# EasyEDA Pro project 缓启动开关工程文件_2024-11-13.epro

# Schematic NMOS低侧开关
Board Name: NMOS低侧开关; Create Date: 2024-10-30; Page Name: P1; Project Name: 缓启动开关; Schematic Name: NMOS低侧开关; Update Date: 2024-10-30; Company: 嘉立创EDA; Page Size: A4; Version: V1.0
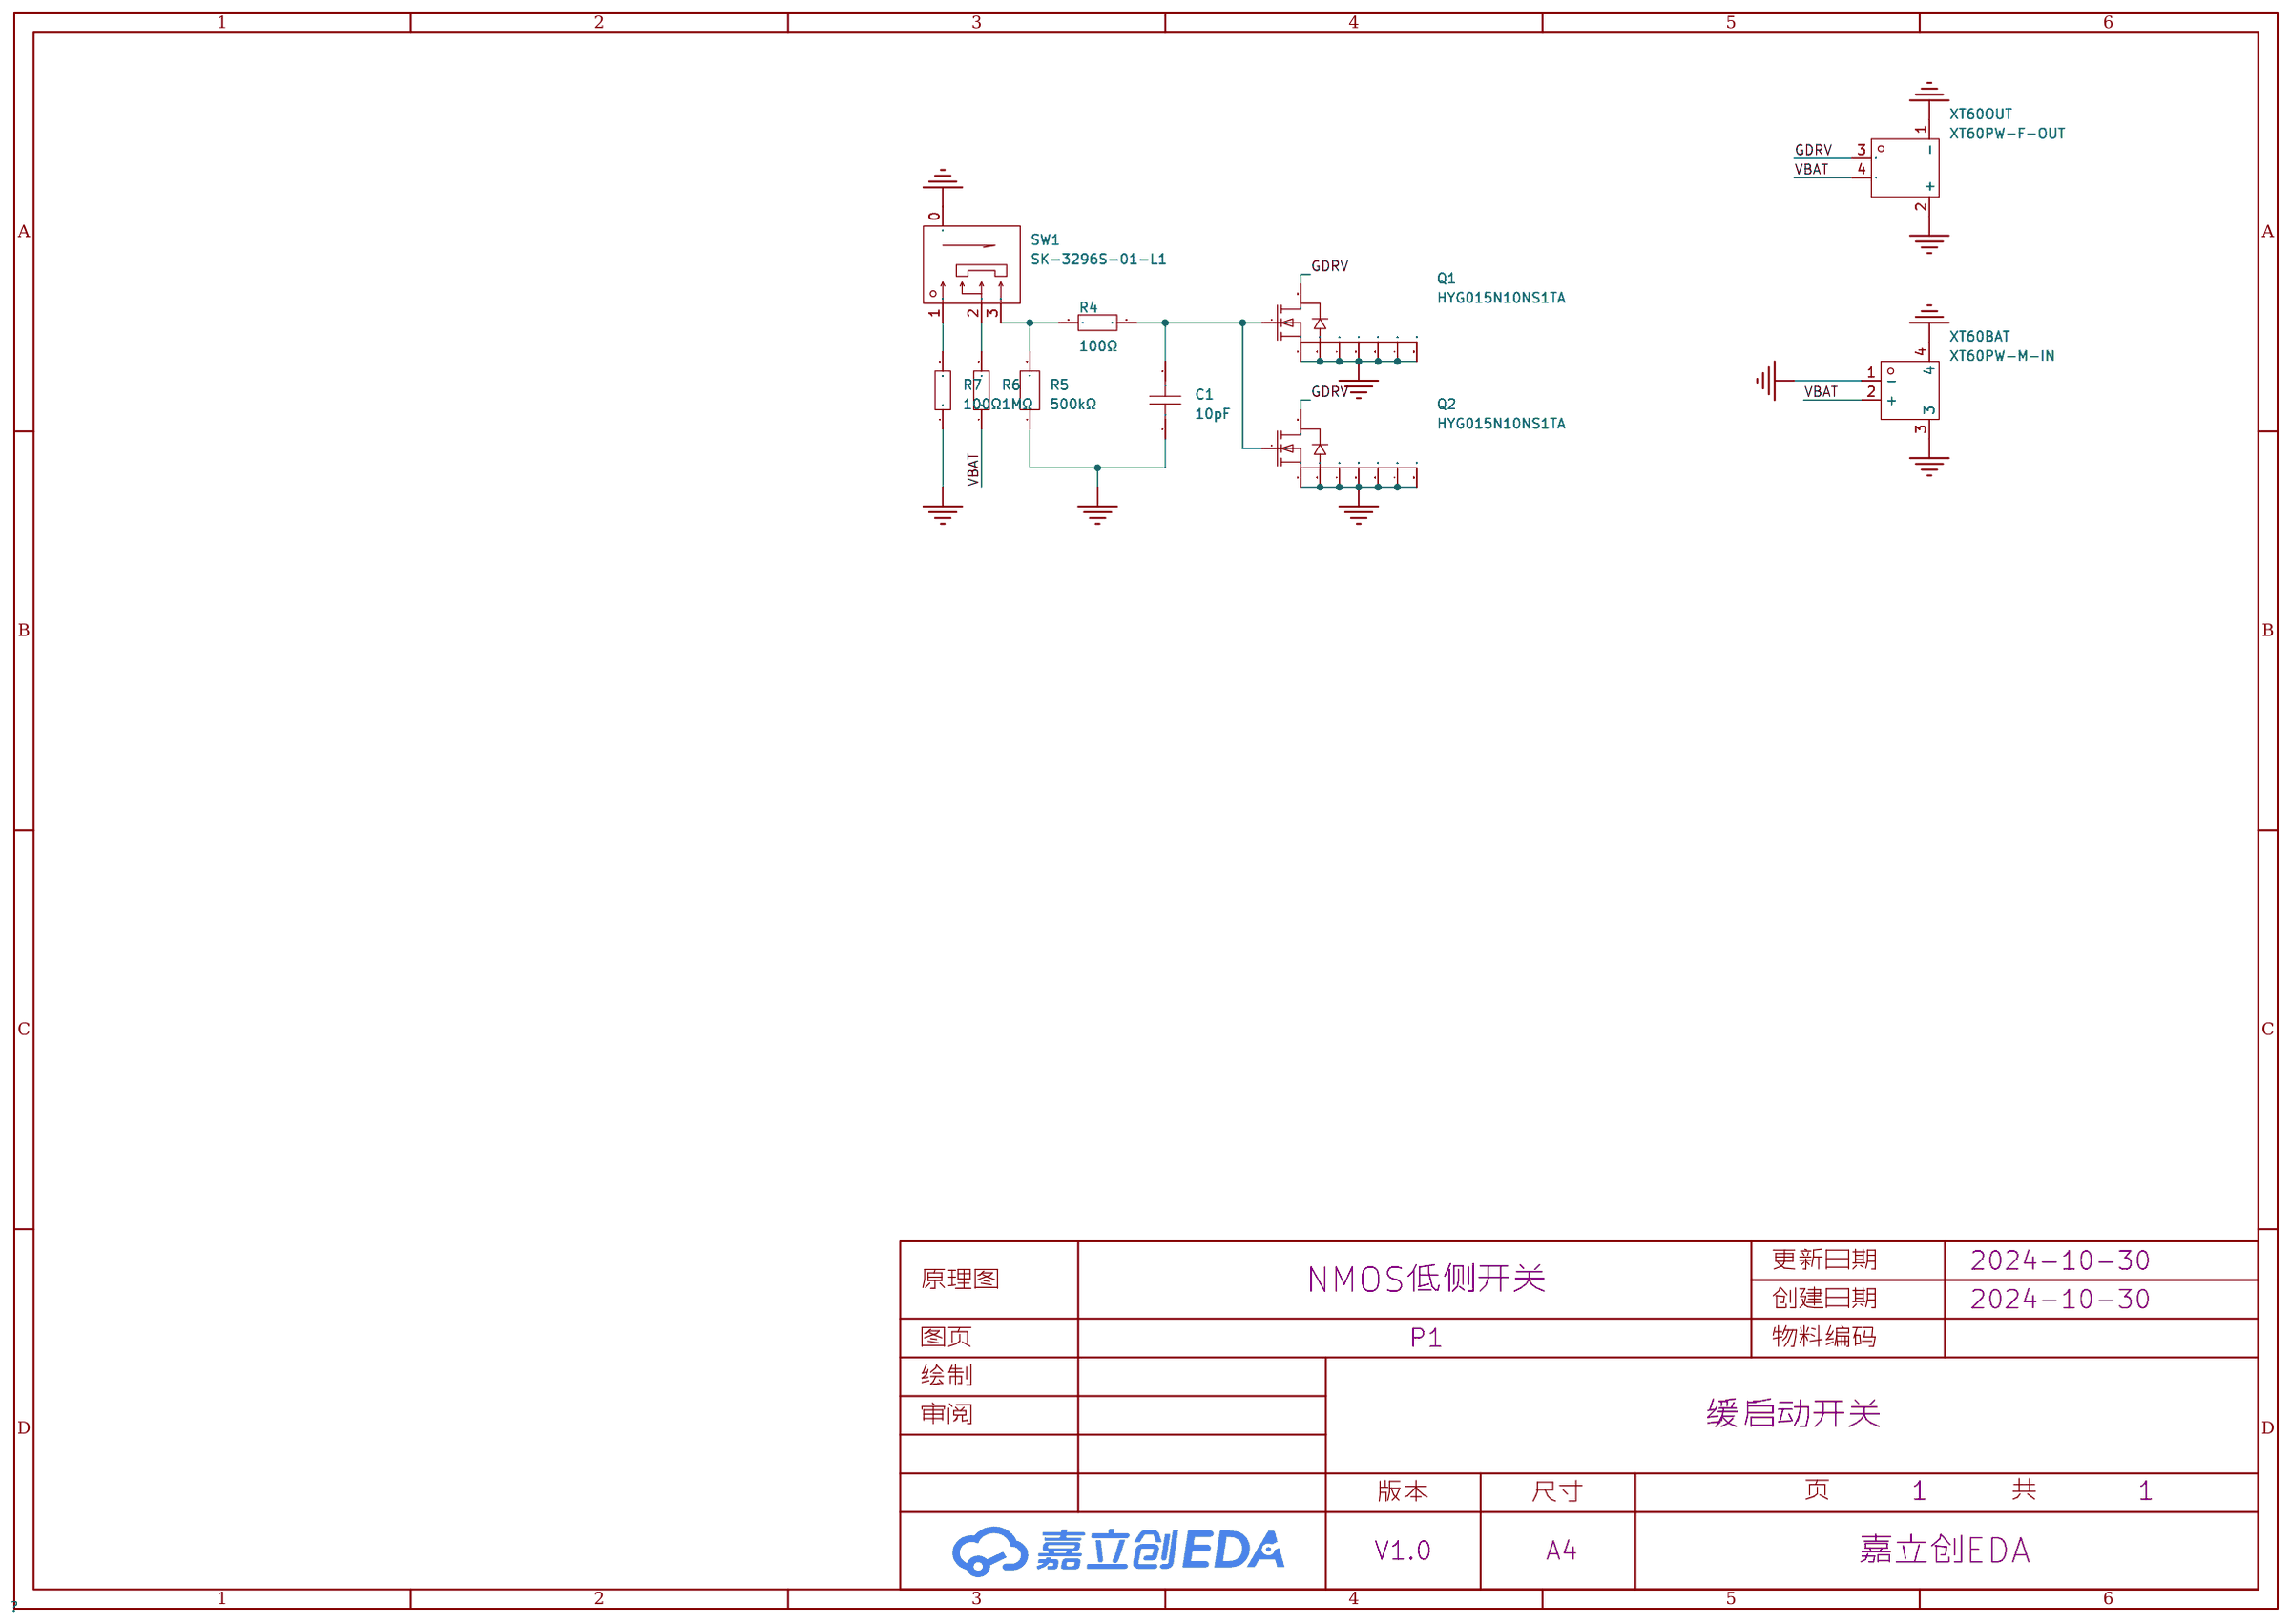
[diagram p0: schematic sheet]

## Parts
C1  10pF  [R0603]
Q1  HYG015N10NS1TA  [TOLL-8_L10.4-W9.9-P1.20-LS11.7-BL]
Q2  HYG015N10NS1TA  [TOLL-8_L10.4-W9.9-P1.20-LS11.7-BL]
R4  100Ω  [R0603]
R5  500kΩ  [R0603]
R6  1MΩ  [R0603]
R7  100Ω  [R0603]
SW1  SK-3296S-01-L1  [SW-SMD_3P-P1.50_L2.7-W6.6]
XT60BAT  XT60PW-M-IN  [CONN-TH_XT60PW-M]
XT60OUT  XT60PW-F-OUT  [TH_2P-XT60PW-F]

## Library data of the parts
C1 = GCM1885C2A100FA16D: 容值:10pF;精度:±1%;额定电压:100V;材质(温度系数):C0G;; LCSC Part Name: 10pF ±1% 100V; Supplier Part: C882577; Manufacturer: muRata(村田); Supplier Footprint: 0603; JLCPCB Part Class: 扩展库; Datasheet: https://atta.szlcsc.com/upload/public/pdf/source/20210506/8597E15C5779E6978C1CE8BB0035B528.pdf; Supplier: LCSC; Tolerance: ±1%; Voltage Rated: 100V; Temperature Coefficient: C0G
Q1 Q2 = HYG015N10NS1TA: 类型:N沟道;漏源电压(Vdss):100V;连续漏极电流(Id):380A;功率(Pd):428.5W;导通电阻(RDS(on)@Vgs,Id):1.2mΩ@10V,100A;阈值电压(Vgs(th)@Id):3V@250uA;; LCSC Part Name: N沟道 耐压:100V 电流:380A; Supplier Part: C2979263; Manufacturer: HUAYI(华羿微); Supplier Footprint: TOLL-8; JLCPCB Part Class: 扩展库; Datasheet: https://atta.szlcsc.com/upload/public/pdf/source/20220303/83427DBE0CDF10F23F3FDD49B9C9CFAE.pdf; Supplier: LCSC; Type: N沟道; Drain Source Voltage (Vdss): 100V; Continuous Drain Current (Id): 380A; Power Dissipation (Pd): 428.5W; Drain Source On Resistance (RDS(on)@Vgs,Id): 1.2mΩ@10V,100A; Gate Threshold Voltage (Vgs(th)@Id): 3V@250uA; Total Gate Charge (Qg@Vgs): 205nC@10V; Input Capacitance (Ciss@Vds): 12.3nF@25V; Reverse Transfer Capacitance (Crss@Vds): 250pF@25V; Operating Temperature: -55℃~+175℃@(Tj)
R4 R7 = 0603WAF1000T5E: 电阻类型:厚膜电阻;阻值:100Ω;精度:±1%;功率:100mW;最大工作电压:75V;温度系数:±200ppm/℃;; LCSC Part Name: 100Ω ±1% 100mW 厚膜电阻; Supplier Part: C22775; Manufacturer: UNI-ROYAL(厚声); Supplier Footprint: 0603; JLCPCB Part Class: 基础库; Datasheet: https://atta.szlcsc.com/upload/public/pdf/source/20200306/C422600_1E6D84923E4A46A82E41ADD87F860B5C.pdf; Supplier: LCSC; Type: 厚膜电阻; Tolerance: ±1%; Power(Watts): 100mW; Overload Voltage (Max): 75V; Temperature Coefficient: ±200ppm/℃; Operating Temperature Range: -55℃~+155℃
R5 = AR03BTCX5003N: 电阻类型:薄膜电阻;阻值:500kΩ;精度:±0.1%;功率:100mW;最大工作电压:50V;温度系数:±25ppm/℃;; LCSC Part Name: 薄膜电阻 500kΩ ±0.1% 100mW; Supplier Part: C2902631; Manufacturer: Viking(光颉); Supplier Footprint: 0603; JLCPCB Part Class: 扩展库; Datasheet: https://atta.szlcsc.com/upload/public/pdf/source/20191129/C465721_10D49275DB41E427863CE9C8D788770A.pdf; Supplier: LCSC; Type: 薄膜电阻; Tolerance: ±0.1%; Power(Watts): 100mW; Overload Voltage (Max): 50V; Temperature Coefficient: ±25ppm/℃; Operating Temperature Range: -55℃~+155℃
R6 = 0603WAF1004T5E: 电阻类型:厚膜电阻;阻值:1MΩ;精度:±1%;功率:100mW;最大工作电压:75V;温度系数:±100ppm/℃;; LCSC Part Name: 1MΩ ±1% 100mW 厚膜电阻; Supplier Part: C22935; Manufacturer: UNI-ROYAL(厚声); Supplier Footprint: 0603; JLCPCB Part Class: 基础库; Datasheet: https://atta.szlcsc.com/upload/public/pdf/source/20200306/C422600_1E6D84923E4A46A82E41ADD87F860B5C.pdf; Supplier: LCSC; Type: 厚膜电阻; Tolerance: ±1%; Power(Watts): 100mW; Overload Voltage (Max): 75V; Temperature Coefficient: ±100ppm/℃; Operating Temperature Range: -55℃~+155℃
SW1 = SK-3296S-01-L1: 电路结构:单刀双掷;安装方式:卧贴;开关颜色:黑色;额定电流(DC):50mA;额定电压(DC):12V;额定电流(AC):50mA;额定电压(AC):12V;机械寿命:1万次;; LCSC Part Name: 柄长1.5mm 卧贴双档 滑动开关; Supplier Part: C319020; Manufacturer: XKB Connectivity(中国星坤); Supplier Footprint: SMD; JLCPCB Part Class: 扩展库; Datasheet: https://atta.szlcsc.com/upload/public/pdf/source/20211011/33977E7F5E3AE40A3E3DC6795807E20F.pdf; Supplier: LCSC; Circuit: 单刀双掷; Actuator Style: 矩形柱状; Pin Style: SMD接片; Switch Length: 7.8mm; Switch Width: 2.75mm; Switch Height: 1.35mm; Mounting Style: 卧贴; Actuator Color: 黑色; Current Rating (DC): 50mA; Voltage Rating (DC): 12V; Current Rating (AC): 50mA; Voltage Rating (AC): 12V; Mechanical Life: 1万次; Operating Temperature: -40℃~+85℃
XT60BAT = XT60PW-M: 类别:-;类型1:-;; LCSC Part Name: AMASS(艾迈斯)航模插头xt60连接器150公母对接pw锂电池公头 板插卧式XT60PW-M; Supplier Part: C98732; Manufacturer: AMASS(艾迈斯); JLCPCB Part Class: 扩展库; Datasheet: https://atta.szlcsc.com/upload/public/pdf/source/20240118/44A3DCFF53BE25DC65378AFFB21277A4.pdf; Supplier: LCSC; Brand: 艾迈斯; Type: 卧式插头; Colour: 黄色; InterfaceType: 公头
XT60OUT = XT60PW-F: 类别:-;类型1:-;; LCSC Part Name: AMASS(艾迈斯)插头连接器锂电池组充电接口 航模电调卧式焊板 母头 XT60PW-F; Supplier Part: C428722; Manufacturer: AMASS(艾迈斯); JLCPCB Part Class: 扩展库; Datasheet: https://atta.szlcsc.com/upload/public/pdf/source/20190916/C428722_DFF78979486FCB0B58C1FC563067EC88.pdf; Supplier: LCSC; Type: 卧式插头; Colour: 黄色; InterfaceType: 母头

## Nets
GND: C1.1 Q1.2(S) Q1.3(S) Q1.4(S) Q1.5(S) Q1.6(S) Q1.7(S) Q1.8(S) Q2.2(S) Q2.3(S) Q2.4(S) Q2.5(S) Q2.6(S) Q2.7(S) Q2.8(S) R5.1 R7.1 SW1.0 XT60BAT.1(-) XT60BAT.3 XT60BAT.4 XT60OUT.1(-) XT60OUT.2(+)
VBAT: R6.1 XT60BAT.2(+) XT60OUT.4
GDRV: Q1.9(D) Q2.9(D) XT60OUT.3
$1N665: R4.1 R5.2 SW1.3
$1N772: R6.2 SW1.2
$1N909: R7.2 SW1.1
Net-(C1-2): C1.2 Q1.1(G) Q2.1(G) R4.2

# Schematic 电荷泵NMOS高侧开关
Board Name: 电荷泵NMOS高侧开关; Create Date: 2024-10-29; Page Name: P1; Project Name: 缓启动开关; Schematic Name: 电荷泵NMOS高侧开关; Update Date: 2024-11-01; Company: 嘉立创EDA; Page Size: A4; Version: V1.0
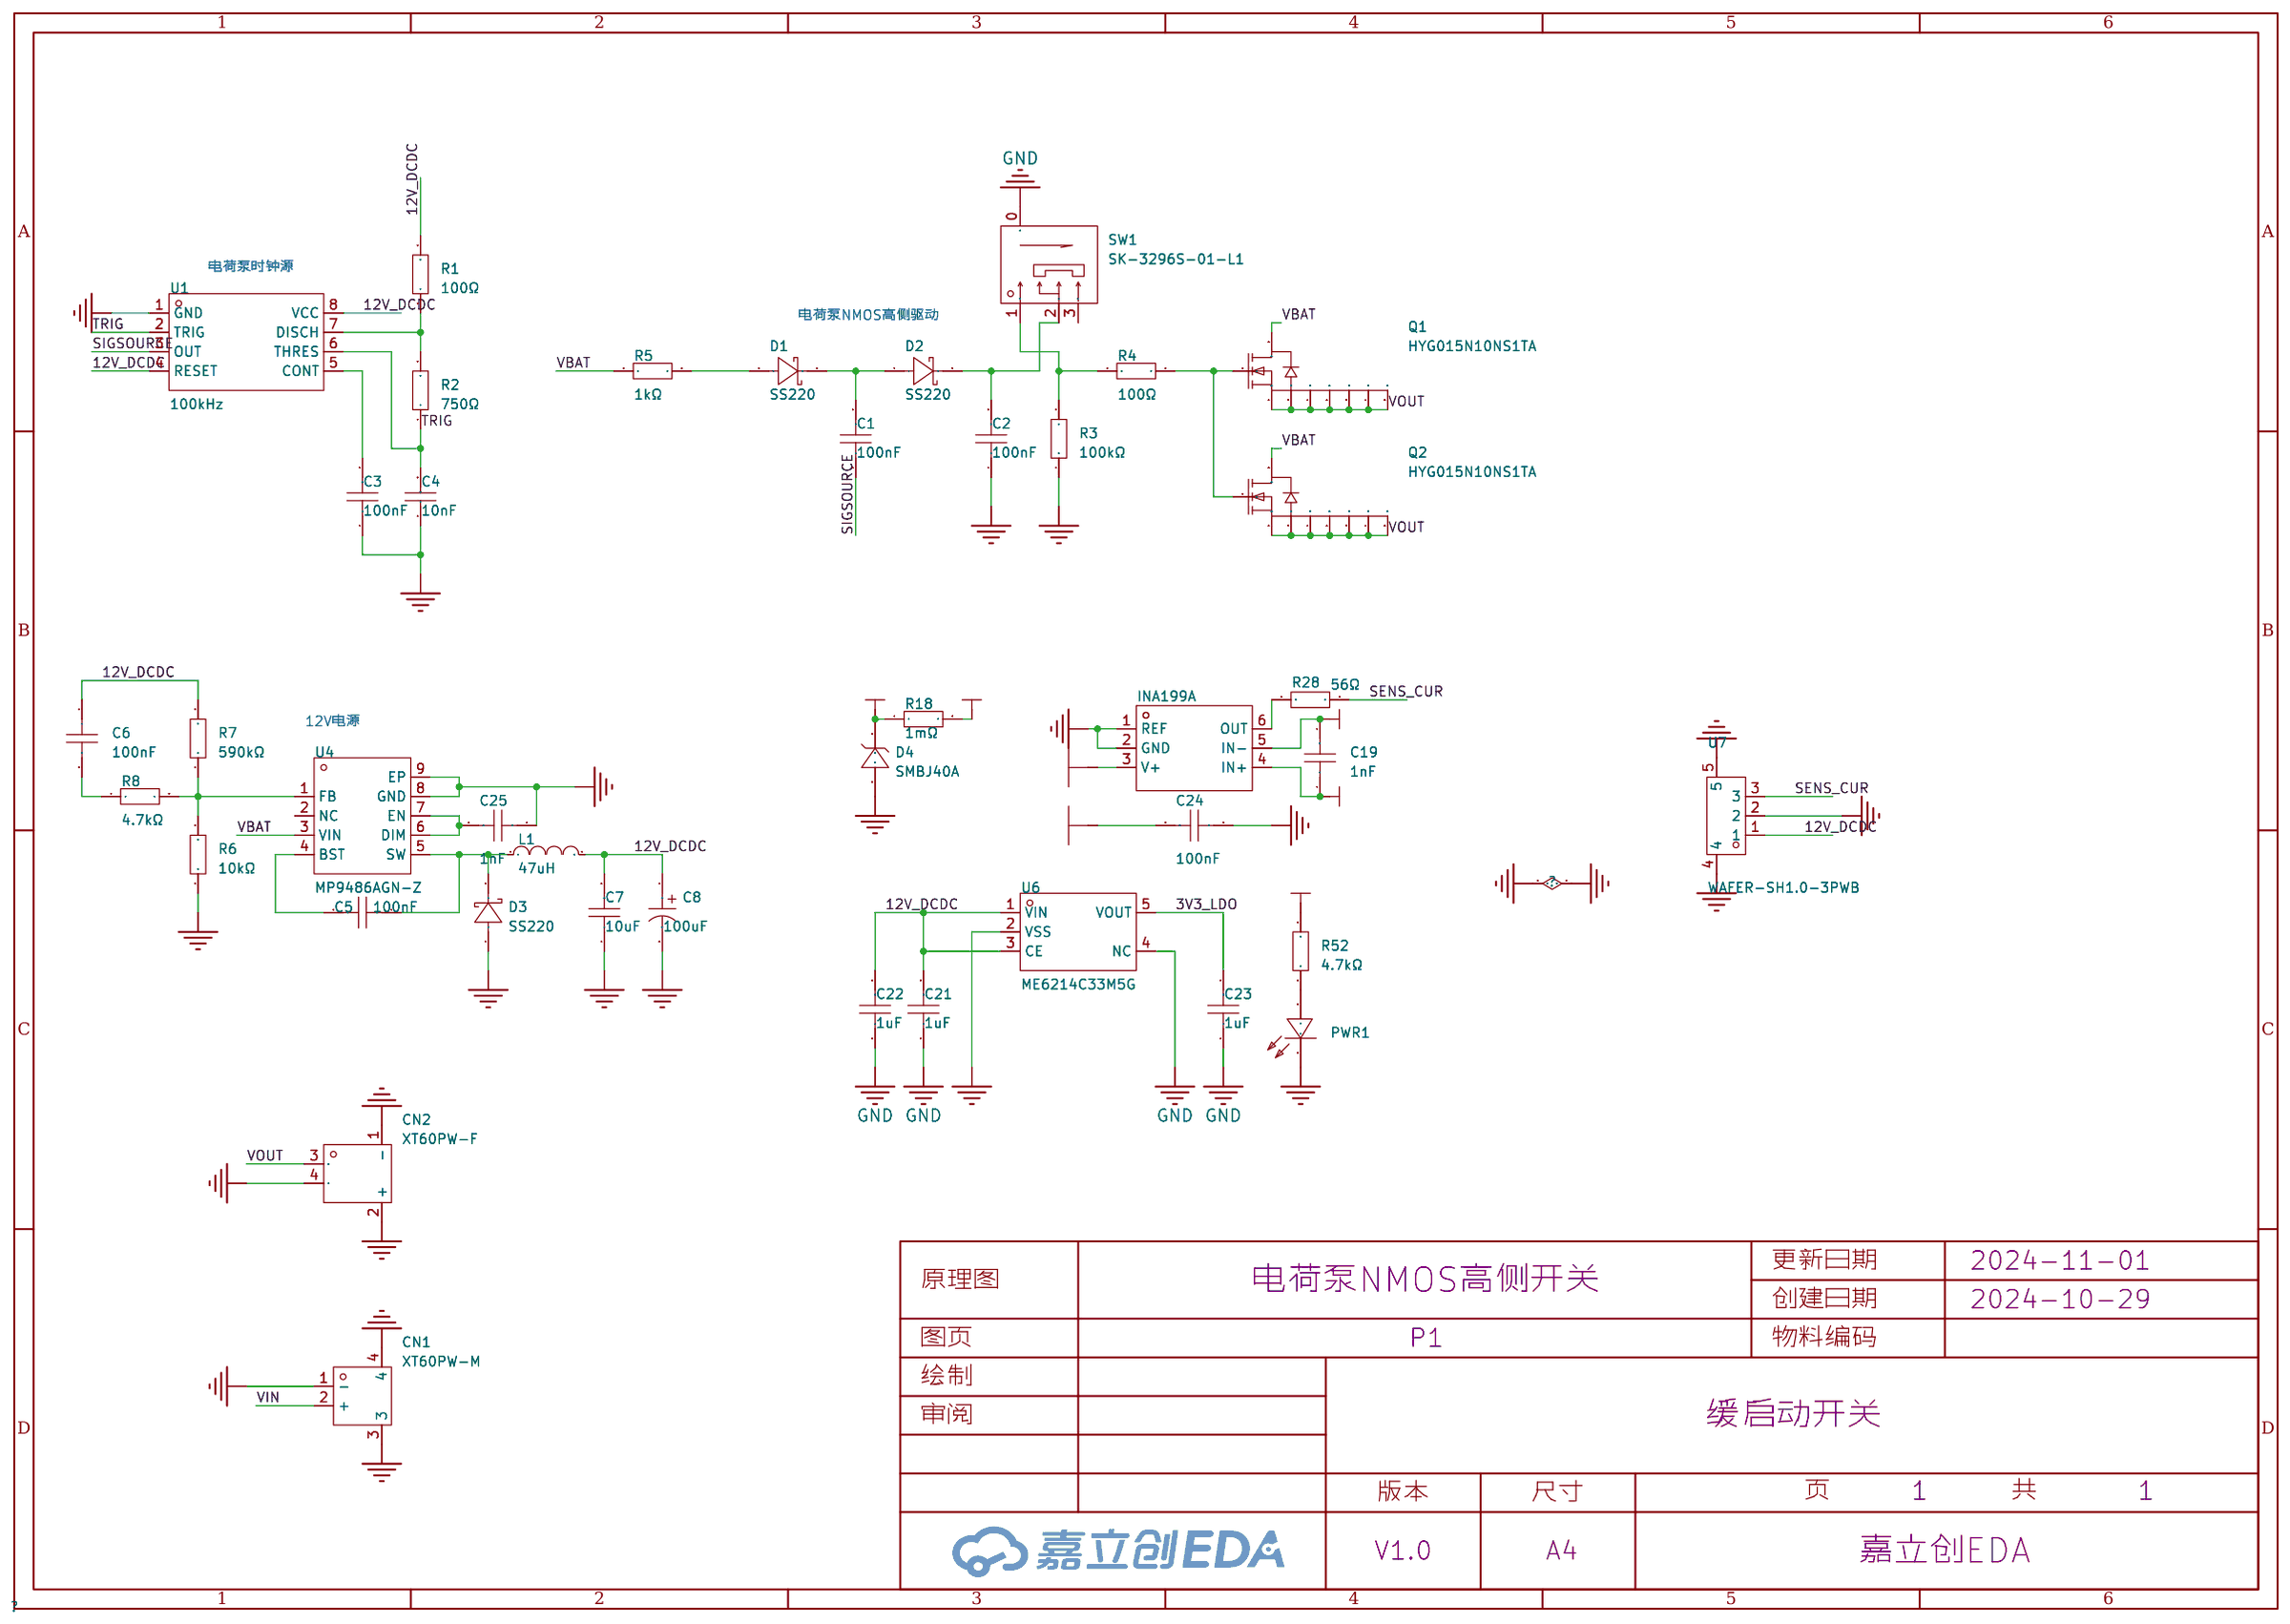
[diagram p1: schematic sheet]

## Parts
C1  100nF  [R0603]
C2  100nF  [R0603]
C3  100nF  [R0603]
C4  10nF  [R0603]
C5  100nF  [R0603]
C6  100nF  [R0603]
C7  10uF  [R0603]
C8  100uF  [cap-smd_bd6.3-l6.6-w6.6-ls7.4-fd]
C19  1nF  [R0603]
C21  1uF  [R0603]
C22  1uF  [R0603]
C23  1uF  [R0603]
C24  100nF  [R0603]
C25  1nF  [R0603]
CN1  XT60PW-M  [CONN-TH_XT60PW-M]
CN2  XT60PW-F  [TH_2P-XT60PW-F]
D1  SS220  [SMA_L4.3-W2.6-LS5.0-FD]
D2  SS220  [SMA_L4.3-W2.6-LS5.0-FD]
D3  SS220  [SMA_L4.3-W2.6-LS5.0-FD]
D4  SMBJ40A  [SMB_L4.3-W3.6-LS5.3-RD]
INA199A  INA199A1DCKR  [SC-70-6_L2.2-W1.3-P0.65-LS2.1-BR]
L1  47uH  [IND-SMD_L4.0-W4.0_FNR40XXS]
PWR1  NCD0603G1  [LED0603-RD]
Q1  HYG015N10NS1TA  [TOLL-8_L10.4-W9.9-P1.20-LS11.7-BL]
Q2  HYG015N10NS1TA  [TOLL-8_L10.4-W9.9-P1.20-LS11.7-BL]
R1  100Ω  [R0603]
R2  750Ω  [R0603]
R3  100kΩ  [R0603]
R4  100Ω  [R0603]
R5  1kΩ  [R0603]
R6  10kΩ  [R0603]
R7  590kΩ  [R0603]
R8  4.7kΩ  [R0603]
R18  1mΩ  [R3920]
R28  56Ω  [R0603]
R52  4.7kΩ  [R0603]
SW1  SK-3296S-01-L1  [SW-SMD_3P-P1.50_L2.7-W6.6]
U1  100kHz  [TSSOP-8_L4.4-W3.0-P0.65-LS6.4-BL]
U4  MP9486AGN-Z  [SOIC-8_L4.9-W3.9-P1.27-LS6.0-BL-EP3.1]
U6  ME6214C33M5G  [SOT-23-5_L3.0-W1.7-P0.95-LS2.8-BL]
U7  WAFER-SH1.0-3PWB  [CONN-SMD_3P-P1.00_WAFER-SH1.0-3PWB]

## Library data of the parts
C1 C2 C5 C6 C24 = CC0603KRX7R0BB104: 容值:100nF;精度:±10%;额定电压:100V;材质(温度系数):X7R;; LCSC Part Name: 100nF ±10% 100V; Supplier Part: C113803; Manufacturer: YAGEO(国巨); Supplier Footprint: 0603; JLCPCB Part Class: 扩展库; Datasheet: https://atta.szlcsc.com/upload/public/pdf/source/20181015/C113803_C823A7F2167996AC3CF21DCEABCAAB90.pdf; Supplier: LCSC; Tolerance: ±10%; Voltage Rated: 100V; Temperature Coefficient: X7R
C3 = CGA0603X7R104K500JT: 容值:100nF;精度:±10%;额定电压:50V;材质(温度系数):X7R;; LCSC Part Name: 100nF ±10% 50V; Supplier Part: C6119867; Manufacturer: HRE(芯声); Supplier Footprint: 0603; JLCPCB Part Class: 扩展库; Supplier: LCSC; Tolerance: ±10%; Voltage Rated: 50V; Temperature Coefficient: X7R
C4 = CC0603KRX7R9BB103: 容值:10nF;精度:±10%;额定电压:50V;材质(温度系数):X7R;; LCSC Part Name: 10nF ±10% 50V; Supplier Part: C100042; Manufacturer: YAGEO(国巨); Supplier Footprint: 0603; JLCPCB Part Class: 扩展库; Datasheet: https://atta.szlcsc.com/upload/public/pdf/source/20181008/C309510_22F155564471FAF6A489F7D68F34234E.pdf; Supplier: LCSC; Tolerance: ±10%; Voltage Rated: 50V; Temperature Coefficient: X7R
C7 = HGC1206R5106K500NSPJ: 容值:10uF;精度:±10%;额定电压:50V;材质(温度系数):X5R;; LCSC Part Name: 10uF ±10% 50V; Supplier Part: C7432781; Manufacturer: Chinocera(华瓷); Supplier Footprint: 1206; JLCPCB Part Class: 扩展库; Datasheet: https://atta.szlcsc.com/upload/public/pdf/source/20240320/FAC3FEC40A78BC5CCCE96C232A94D860.pdf; Supplier: LCSC; Tolerance: ±10%; Voltage Rated: 50V; Temperature Coefficient: X5R
C8 = RVT100UF35V67RV0034: 容值:100uF;精度:±20%;额定电压:35V;纹波电流:87mA@120kHz;等效串联电阻:-;; LCSC Part Name: 100uF ±20% 35V; Supplier Part: C2836442; Manufacturer: KNSCHA(科尼盛); Supplier Footprint: SMD,D6.3xL7.7mm; JLCPCB Part Class: 扩展库; Datasheet: https://atta.szlcsc.com/upload/public/pdf/source/20210528/C2836442_7F6389BF36F63F32D6DF3A507E8E95D6.pdf; Supplier: LCSC; Tolerance: ±20%; Rated Voltage: 35V; Ripple Current: 87mA@120kHz; φD: 6.3mm; L: 7.7mm; Lifetime @ Temp: 2000hrs@105℃; Operating Temperature: -55℃~+105℃
C19 C25 = CAP_0402: 容值:100nF;精度:±10%;额定电压:16V;温度系数:X7R;; Supplier Part: C1525; Supplier Footprint: 0402
C21-C23 = CL10A105KB8NNNC: 容值:1uF;精度:±10%;额定电压:50V;材质(温度系数):X5R;; LCSC Part Name: 1uF ±10% 50V; Supplier Part: C15849; Manufacturer: SAMSUNG(三星); Supplier Footprint: 0603; JLCPCB Part Class: 基础库; Datasheet: https://atta.szlcsc.com/upload/public/pdf/source/20160218/1457707763339.pdf; Supplier: LCSC; Tolerance: ±10%; Voltage Rated: 50V; Temperature Coefficient: X5R
CN1 = XT60PW-M: 类别:-;类型1:-;; LCSC Part Name: AMASS(艾迈斯)航模插头xt60连接器150公母对接pw锂电池公头 板插卧式XT60PW-M; Supplier Part: C98732; Manufacturer: AMASS(艾迈斯); JLCPCB Part Class: 扩展库; Datasheet: https://atta.szlcsc.com/upload/public/pdf/source/20240118/44A3DCFF53BE25DC65378AFFB21277A4.pdf; Supplier: LCSC; Brand: 艾迈斯; Type: 卧式插头; Colour: 黄色; InterfaceType: 公头
CN2 = XT60PW-F: 类别:-;类型1:-;; LCSC Part Name: AMASS(艾迈斯)插头连接器锂电池组充电接口 航模电调卧式焊板 母头 XT60PW-F; Supplier Part: C428722; Manufacturer: AMASS(艾迈斯); JLCPCB Part Class: 扩展库; Datasheet: https://atta.szlcsc.com/upload/public/pdf/source/20190916/C428722_DFF78979486FCB0B58C1FC563067EC88.pdf; Supplier: LCSC; Type: 卧式插头; Colour: 黄色; InterfaceType: 母头
D1-D3 = SS220_C7420361: 二极管配置:独立式;正向压降(Vf):950mV@2A;直流反向耐压(Vr):200V;平均整流电流(Io):2A;; LCSC Part Name: 电压:200V 电流:2A; Supplier Part: C7420361; Manufacturer: 宏迦橙; Supplier Footprint: SMA(DO-214AC); JLCPCB Part Class: 扩展库; Datasheet: https://atta.szlcsc.com/upload/public/pdf/source/20230828/2D67628D7EFDC2DD386D167E8AEA232D.pdf; Supplier: LCSC; Diode Configuration: 独立式; Forward Voltage (Vf@If): 950mV@2A; Reverse Voltage (Vr): 200V; Average Rectified Current (Io): 2A; Reverse Leakage Current (Ir): 50uA@200V; Peak forward surge current: 50A
D4 = SMBJ40A_C2989898: 反向截止电压(Vrwm):40V;最大钳位电压:64.5V;峰值脉冲电流(Ipp)@10/1000us:9.3A;峰值脉冲功率(Ppp)@10/1000us:600W;击穿电压:44.4V;; Supplier Part: C2989898; Manufacturer: Liown(里阳半导体); Supplier Footprint: SMB; JLCPCB Part Class: 扩展库; Datasheet: https://atta.szlcsc.com/upload/public/pdf/source/20231227/03AB1CAA057903440EC8583E8018C05E.pdf; Supplier: LCSC; Reverse Stand-Off Voltage (Vrwm): 40V; Maximum Clamping Voltage: 64.5V; Peak Pulse Current (Ipp)@10/1000us: 9.3A; Peak Pulse Power Dissipation (Ppp)@10/1000us: 600W; Breakdown Voltage: 44.4V; Reverse Leakage Current (Ir): 1uA; Type: TVS
INA199A = INA199A1DCKR: INA199 26V、双向、零漂移、低侧/高侧、电压输出分流监控器; Supplier Part: C59135; Manufacturer: TI(德州仪器); Supplier Footprint: SC-70-6(SOT-363); JLCPCB Part Class: Extended Part; Datasheet: https://atta.szlcsc.com/upload/public/pdf/source/20150921/1457707392422.pdf; Supplier: LCSC
L1 = FNR4030S470MT: 电感值:47uH;精度:±20%;额定电流:800mA;饱和电流(Isat):1A;; LCSC Part Name: 47uH ±20% 1A; Supplier Part: C167888; Manufacturer: cjiang(长江微电); Supplier Footprint: SMD,4x4mm; JLCPCB Part Class: 扩展库; Datasheet: https://atta.szlcsc.com/upload/public/pdf/source/20190327/C167925_9EFF0AABC4CA629C2CC95961DBF7D39D.pdf; Supplier: LCSC; Tolerance: ±20%; Rated Current: 800mA; Saturation Current (Isat): 1A; DC Resistance (DCR): 579mΩ
PWR1 = NCD0603G1: 发光颜色:翠绿色;正向电压(VF):2.6V~3.6V;功率:72mW;正向电流:10mA;主波长:515nm~530nm;透镜颜色:无色透明透镜;发光强度:330mcd~900mcd;发光角度:130°;工作温度:-30℃~+85℃;; Supplier Part: C84267; Manufacturer: 国星光电; Supplier Footprint: 0603; JLCPCB Part Class: Extended Part; Datasheet: https://atta.szlcsc.com/upload/public/pdf/source/20200820/C84267_04BA7703640BAC111D09F5EFB971FBF3.pdf; Supplier: LCSC; Emitted Color: 翠绿色; Forward Voltage (VF): 2.6V~3.6V; Power Dissipation: 72mW; Forward Current: 10mA; Dominant Wavelength: 515nm~530nm; Lens Color: 无色透明透镜; Luminous Intensity: 330mcd~900mcd; Viewing Angle: 130°; Operating Temperature: -30℃~+85℃
Q1 Q2 = HYG015N10NS1TA: 类型:N沟道;漏源电压(Vdss):100V;连续漏极电流(Id):380A;功率(Pd):428.5W;导通电阻(RDS(on)@Vgs,Id):1.2mΩ@10V,100A;阈值电压(Vgs(th)@Id):3V@250uA;; LCSC Part Name: N沟道 耐压:100V 电流:380A; Supplier Part: C2979263; Manufacturer: HUAYI(华羿微); Supplier Footprint: TOLL-8; JLCPCB Part Class: 扩展库; Datasheet: https://atta.szlcsc.com/upload/public/pdf/source/20220303/83427DBE0CDF10F23F3FDD49B9C9CFAE.pdf; Supplier: LCSC; Type: N沟道; Drain Source Voltage (Vdss): 100V; Continuous Drain Current (Id): 380A; Power Dissipation (Pd): 428.5W; Drain Source On Resistance (RDS(on)@Vgs,Id): 1.2mΩ@10V,100A; Gate Threshold Voltage (Vgs(th)@Id): 3V@250uA; Total Gate Charge (Qg@Vgs): 205nC@10V; Input Capacitance (Ciss@Vds): 12.3nF@25V; Reverse Transfer Capacitance (Crss@Vds): 250pF@25V; Operating Temperature: -55℃~+175℃@(Tj)
R1 R4 = 0603WAF1000T5E: 电阻类型:厚膜电阻;阻值:100Ω;精度:±1%;功率:100mW;最大工作电压:75V;温度系数:±200ppm/℃;; LCSC Part Name: 100Ω ±1% 100mW 厚膜电阻; Supplier Part: C22775; Manufacturer: UNI-ROYAL(厚声); Supplier Footprint: 0603; JLCPCB Part Class: 基础库; Datasheet: https://atta.szlcsc.com/upload/public/pdf/source/20200306/C422600_1E6D84923E4A46A82E41ADD87F860B5C.pdf; Supplier: LCSC; Type: 厚膜电阻; Tolerance: ±1%; Power(Watts): 100mW; Overload Voltage (Max): 75V; Temperature Coefficient: ±200ppm/℃; Operating Temperature Range: -55℃~+155℃
R2 = 0603WAF7500T5E: 电阻类型:厚膜电阻;阻值:750Ω;精度:±1%;功率:100mW;最大工作电压:75V;温度系数:±100ppm/℃;; LCSC Part Name: 750Ω ±1% 100mW 厚膜电阻; Supplier Part: C23241; Manufacturer: UNI-ROYAL(厚声); Supplier Footprint: 0603; JLCPCB Part Class: 扩展库; Datasheet: https://atta.szlcsc.com/upload/public/pdf/source/20200306/C422600_1E6D84923E4A46A82E41ADD87F860B5C.pdf; Supplier: LCSC; Type: 厚膜电阻; Tolerance: ±1%; Power(Watts): 100mW; Overload Voltage (Max): 75V; Temperature Coefficient: ±100ppm/℃; Operating Temperature Range: -55℃~+155℃
R3 = 0603WAF1003T5E: 电阻类型:厚膜电阻;阻值:100kΩ;精度:±1%;功率:100mW;最大工作电压:75V;温度系数:±100ppm/℃;; LCSC Part Name: 100kΩ ±1% 100mW 厚膜电阻; Supplier Part: C25803; Manufacturer: UNI-ROYAL(厚声); Supplier Footprint: 0603; JLCPCB Part Class: 基础库; Datasheet: https://atta.szlcsc.com/upload/public/pdf/source/20200306/C422600_1E6D84923E4A46A82E41ADD87F860B5C.pdf; Supplier: LCSC; Type: 厚膜电阻; Tolerance: ±1%; Power(Watts): 100mW; Overload Voltage (Max): 75V; Temperature Coefficient: ±100ppm/℃; Operating Temperature Range: -55℃~+155℃
R5 = 0603WAF1001T5E: 电阻类型:厚膜电阻;阻值:1kΩ;精度:±1%;功率:100mW;最大工作电压:75V;温度系数:±100ppm/℃;; LCSC Part Name: 1kΩ ±1% 100mW 厚膜电阻; Supplier Part: C21190; Manufacturer: UNI-ROYAL(厚声); Supplier Footprint: 0603; JLCPCB Part Class: 基础库; Datasheet: https://atta.szlcsc.com/upload/public/pdf/source/20200306/C422600_1E6D84923E4A46A82E41ADD87F860B5C.pdf; Supplier: LCSC; Type: 厚膜电阻; Tolerance: ±1%; Power(Watts): 100mW; Overload Voltage (Max): 75V; Temperature Coefficient: ±100ppm/℃; Operating Temperature Range: -55℃~+155℃
R6 = 0603WAF1002T5E: 电阻类型:厚膜电阻;阻值:10kΩ;精度:±1%;功率:100mW;最大工作电压:75V;温度系数:±100ppm/℃;; LCSC Part Name: 厚膜电阻 10kΩ ±1% 100mW; Supplier Part: C25804; Manufacturer: UNI-ROYAL(厚声); Supplier Footprint: 0603; JLCPCB Part Class: 基础库; Datasheet: https://atta.szlcsc.com/upload/public/pdf/source/20200306/C422600_1E6D84923E4A46A82E41ADD87F860B5C.pdf; Supplier: LCSC; Type: 厚膜电阻; Tolerance: ±1%; Power(Watts): 100mW; Overload Voltage (Max): 75V; Temperature Coefficient: ±100ppm/℃; Operating Temperature Range: -55℃~+155℃
R7 = 0603WAF5903T5E: 电阻类型:厚膜电阻;阻值:590kΩ;精度:±1%;功率:100mW;最大工作电压:75V;温度系数:±100ppm/℃;; LCSC Part Name: 590kΩ ±1% 100mW 厚膜电阻; Supplier Part: C23208; Manufacturer: UNI-ROYAL(厚声); Supplier Footprint: 0603; JLCPCB Part Class: 扩展库; Datasheet: https://atta.szlcsc.com/upload/public/pdf/source/20200306/C422600_1E6D84923E4A46A82E41ADD87F860B5C.pdf; Supplier: LCSC; Type: 厚膜电阻; Tolerance: ±1%; Power(Watts): 100mW; Overload Voltage (Max): 75V; Temperature Coefficient: ±100ppm/℃; Operating Temperature Range: -55℃~+155℃
R8 = 0603WAF4701T5E: 电阻类型:厚膜电阻;阻值:4.7kΩ;精度:±1%;功率:100mW;最大工作电压:75V;温度系数:±100ppm/℃;; LCSC Part Name: 4.7kΩ ±1% 100mW 厚膜电阻; Supplier Part: C23162; Manufacturer: UNI-ROYAL(厚声); Supplier Footprint: 0603; JLCPCB Part Class: 基础库; Datasheet: https://atta.szlcsc.com/upload/public/pdf/source/20200306/C422600_1E6D84923E4A46A82E41ADD87F860B5C.pdf; Supplier: LCSC; Type: 厚膜电阻; Tolerance: ±1%; Power(Watts): 100mW; Overload Voltage (Max): 75V; Temperature Coefficient: ±100ppm/℃; Operating Temperature Range: -55℃~+155℃
R18 = HoXGS1050-5W-1mR-1%: 电阻类型:采样电阻;阻值:1mΩ;精度:±1%;功率:5W;温度系数:±50ppm/℃;安装方式:贴片;; LCSC Part Name: 1mΩ ±1% 5W; Supplier Part: C4944054; Manufacturer: Milliohm(毫欧); Supplier Footprint: 3920; JLCPCB Part Class: Extended Part; Datasheet: https://atta.szlcsc.com/upload/public/pdf/source/20220822/C44A6B7578715DE720ECDEBD68CB02E3.pdf; Supplier: LCSC; Type: 采样电阻; Tolerance: ±1%; Power(Watts): 5W; Temperature Coefficient: ±50ppm/℃; Mounting Sytle: 贴片
R28 = 0603WAF560JT5E: 电阻类型:厚膜电阻;阻值:56Ω;精度:±1%;功率:100mW;最大工作电压:75V;温度系数:±200ppm/℃;; LCSC Part Name: 56Ω ±1% 100mW 厚膜电阻; Supplier Part: C25196; Manufacturer: UNI-ROYAL(厚声); Supplier Footprint: 0603; JLCPCB Part Class: Extended Part; Datasheet: https://atta.szlcsc.com/upload/public/pdf/source/20200306/C422600_1E6D84923E4A46A82E41ADD87F860B5C.pdf; Supplier: LCSC; Type: 厚膜电阻; Tolerance: ±1%; Power(Watts): 100mW; Overload Voltage (Max): 75V; Temperature Coefficient: ±200ppm/℃; Operating Temperature Range: -55℃~+155℃
R52 = 0603WAF4701T5E: 电阻类型:厚膜电阻;阻值:4.7kΩ;精度:±1%;功率:100mW;最大工作电压:75V;温度系数:±100ppm/℃;; LCSC Part Name: 4.7kΩ ±1% 100mW 厚膜电阻; Supplier Part: C23162; Manufacturer: UNI-ROYAL(厚声); Supplier Footprint: 0603; JLCPCB Part Class: Basic Part; Datasheet: https://atta.szlcsc.com/upload/public/pdf/source/20200306/C422600_1E6D84923E4A46A82E41ADD87F860B5C.pdf; Supplier: LCSC; Type: 厚膜电阻; Tolerance: ±1%; Power(Watts): 100mW; Overload Voltage (Max): 75V; Temperature Coefficient: ±100ppm/℃; Operating Temperature Range: -55℃~+155℃
SW1 = SK-3296S-01-L1: 电路结构:单刀双掷;安装方式:卧贴;开关颜色:黑色;额定电流(DC):50mA;额定电压(DC):12V;额定电流(AC):50mA;额定电压(AC):12V;机械寿命:1万次;; LCSC Part Name: 柄长1.5mm 卧贴双档 滑动开关; Supplier Part: C319020; Manufacturer: XKB Connectivity(中国星坤); Supplier Footprint: SMD; JLCPCB Part Class: 扩展库; Datasheet: https://atta.szlcsc.com/upload/public/pdf/source/20211011/33977E7F5E3AE40A3E3DC6795807E20F.pdf; Supplier: LCSC; Circuit: 单刀双掷; Actuator Style: 矩形柱状; Pin Style: SMD接片; Switch Length: 7.8mm; Switch Width: 2.75mm; Switch Height: 1.35mm; Mounting Style: 卧贴; Actuator Color: 黑色; Current Rating (DC): 50mA; Voltage Rating (DC): 12V; Current Rating (AC): 50mA; Voltage Rating (AC): 12V; Mechanical Life: 1万次; Operating Temperature: -40℃~+85℃
U1 = NE555PWR: 频率:100kHz;; Supplier Part: C105643; Manufacturer: TI(德州仪器); Supplier Footprint: TSSOP-8; JLCPCB Part Class: 扩展库; Datasheet: https://www.ti.com/cn/lit/gpn/ne555; Supplier: LCSC; Supply Voltage: 4.5V~16V; Supply Current: 10mA; Operating Temperature: 0℃~+70℃
U4 = MP9486AGN-Z: 功能类型:降压型;输出类型:固定;输入电压:4.5V~95V;输出电压:5V;输出电流:1A;; Supplier Part: C404013; Manufacturer: MPS(芯源); Supplier Footprint: SOIC-8-EP; JLCPCB Part Class: 扩展库; Datasheet: https://atta.szlcsc.com/upload/public/pdf/source/20240315/A4278CB7934BC519F5699CB4654BA077.pdf; Supplier: LCSC; Function: 降压型; Output Type: 固定; Input Voltage: 4.5V~95V; Output Voltage: 5V; Output Current: 1A; Switching Frequency: 1MHz; Operating Temperature: -40℃~+125℃@(TJ); Synchronous Rectification: 否; Number of Outputs: 1; Topology: 降压式; Switch tube (built-in/external): 内置
U6 = ME6214C33M5G: 输出类型:固定;最大输入电压:18V;输出电压:3.3V;最大输出电流:300mA;电源纹波抑制比(PSRR):-;输出极性:正极;; LCSC Part Name: 输入18V 输出3.3V 300mA; Supplier Part: C76500; Manufacturer: MICRONE(南京微盟); Supplier Footprint: SOT-23-5; JLCPCB Part Class: 扩展库; Datasheet: https://atta.szlcsc.com/upload/public/pdf/source/20190628/C76500_8C40FD23FABB9ADD019D3F4B42283547.pdf; Supplier: LCSC; Output Type: 固定; Maximum Input Voltage: 18V; Output Voltage: 3.3V; MAX Output Current: 300mA; Dropout Voltage: 320mV@(200mA); Output Polarity: 正极; Number of Outputs: 1
U7 = WAFER-SH1.0-3PWB: 插针结构:1x3P;间距:1mm;安装方式:卧贴;总PIN数:3P;排数:1;每排PIN数:3;额定电流:1A;工作温度范围:-25℃~+85℃;; LCSC Part Name: 1x3P 间距:1mm 卧贴; Supplier Part: C3029342; Manufacturer: XUNPU(讯普); Supplier Footprint: SMD,P=1mm,卧贴; JLCPCB Part Class: 扩展库; Datasheet: https://atta.szlcsc.com/upload/public/pdf/source/20220527/1879B8210BD3B2006BCEAC1A40D397B6.pdf; Supplier: LCSC; Pins Structure: 1x3P; Pitch: 1mm; Mounting Style: 卧贴; Number of Pins: 3P; Number of Rows: 1; Number of PINs Per Row: 3; Current Rating (Max): 1A; Operating Temperature Range: -25℃~+85℃

## Nets
3V3_LDO: C23.2 C24.2 INA199A.3(V+) R52.1 U6.5(VOUT)
12V_DCDC: C6.1 C7.2 C8.1 C21.2 C22.2 L1.2 R1.2 R7.2 U1.4(RESET) U1.8(VCC) U6.1(VIN) U6.3(CE) U7.1
AGND: C2.1 C3.1 C4.1 C7.1 C8.2 C21.1 C22.1 C23.1 C24.1 C25.1 CN1.1(-) CN1.3 CN1.4 CN2.1(-) CN2.2(+) CN2.4 D3.1(A) D4.2 INA199A.1(REF) INA199A.2(GND) PWR1.1(K) R3.1 R6.1 SW1.0 U1.1(GND) U4.8(GND) U4.9(EP) U6.2(VSS) U6.4(NC) U7.2 U7.4 U7.5
VBAT: C19.2 INA199A.5(IN-) Q1.9(D) Q2.9(D) R5.1 R18.2 U4.3(VIN)
VIN: C19.1 CN1.2(+) D4.1 INA199A.4(IN+) R18.1
SENS_CUR: R28.2 U7.3
SIGSOURCE: C1.1 U1.3(OUT)
TRIG: C4.2 R2.1 U1.2(TRIG) U1.6(THRES)
VOUT: CN2.3 Q1.2(S) Q1.3(S) Q1.4(S) Q1.5(S) Q1.6(S) Q1.7(S) Q1.8(S) Q2.2(S) Q2.3(S) Q2.4(S) Q2.5(S) Q2.6(S) Q2.7(S) Q2.8(S)
$1N251: C1.2 D1.2(K) D2.1(A)
$1N589: R1.1 R2.2 U1.7(DISCH)
$1N672: C3.2 U1.5(CONT)
$1N1162: Q1.1(G) Q2.1(G) R4.2
$1N1165: R3.2 R4.1 SW1.1
$1N1432: C2.2 D2.2(K) SW1.2
$1N1532: D1.1(A) R5.2
$1N2915: C5.2 U4.4(BST)
$1N2959: C5.1 D3.2(K) L1.1 U4.5(SW)
$1N3050: C25.2 U4.6(DIM) U4.7(EN)
$1N3363: R6.2 R7.1 R8.2 U4.1(FB)
$1N3435: C6.2 R8.1
$1N4038: INA199A.6(OUT) R28.1
$1N4588: PWR1.2(A) R52.2

Not connected (* = marked no-connect by the designer): SW1 3; U4 2(NC)

## Notes on the sheet
- 电荷泵时钟源
- 电荷泵NMOS高侧驱动
- 12V电源

# Board NMOS低侧开关
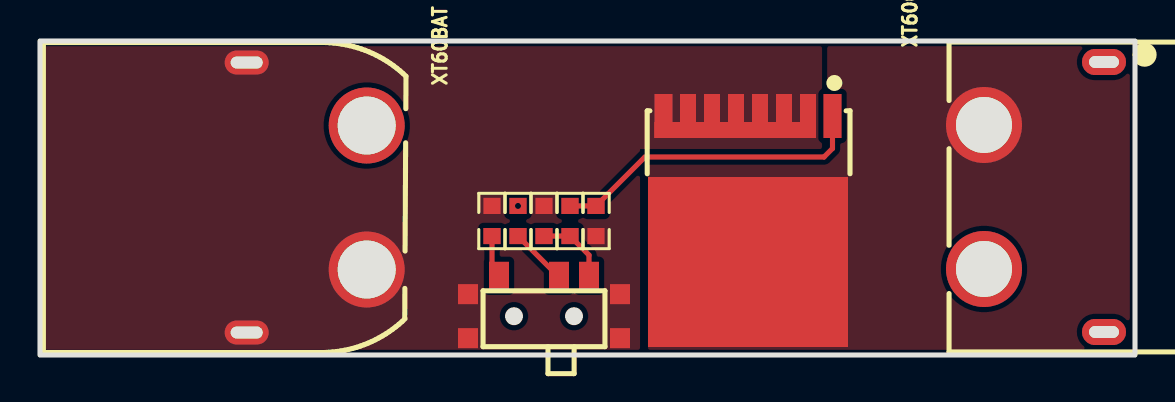
[diagram p2: board, top side]
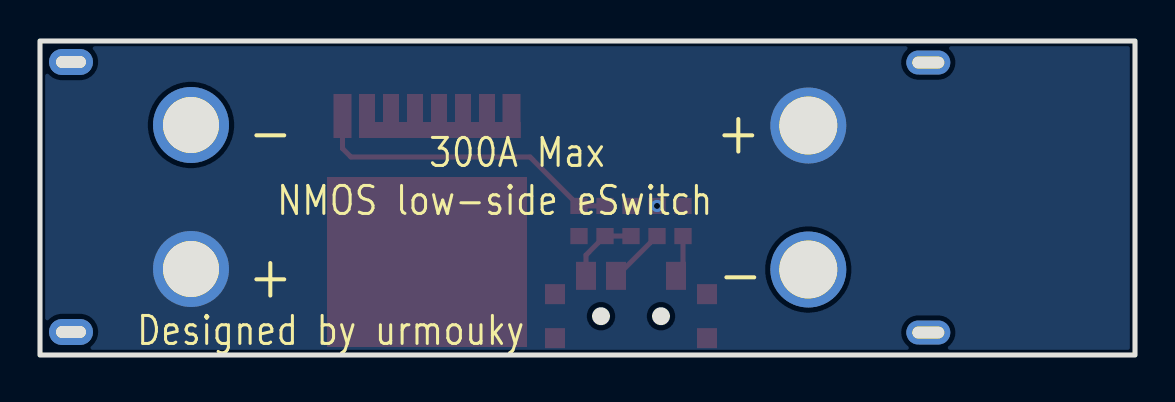
[diagram p3: board, bottom side, seen from below]

Outline 54.75 x 15.7 mm; copper layers: Top Layer, Bottom Layer. Coordinates in mm from the lower left corner of the outline.
Outline path: rectangle 0,15.7 54.75,0
Stack: Top Layer 0.035mm / Dielectric1 1.51mm FR4 er 4.5 / Bottom Layer 0.035mm

## Design rules (mm)
template: 自定义配置
spacing copperThickness1oz (default): track to track 0.102, other pairs 0.152 to 0.3
spacing copperThickness2oz: track to track 0.203, other pairs 0.152 to 0.3
track width copperThickness1oz (default): min 0.127, default 0.254, max 2.54
track width copperThickness2oz: min 0.203, default 0.254, max 2.54
differential pair differentialPair (default): width min 0.127, default 0.254, max 2.54; gap min 0.152, default 0.152
via viaSize (default): diameter min 0.5, default 0.61, max 10; hole min 0.3, default 0.305, max 6.3

## Placement (name value [footprint] x y rotation side)
C1  10pF  [R0603]  27.8 6.7 90 top
Q2  HYG015N10NS1TA  [TOLL-8_L10.4-W9.9-P1.20-LS11.7-BL]  35.4 8.3 180 top
R4  100Ω  [R0603]  26.5 6.7 90 top
R5  500kΩ  [R0603]  25.2 6.7 270 top
R6  1MΩ  [R0603]  23.9 6.7 270 top
R7  100Ω  [R0603]  22.6 6.7 270 top
SW1  SK-3296S-01-L1  [SW-SMD_3P-P1.50_L2.7-W6.6]  25.2 2.4 0 top
XT60BAT  XT60PW-M-IN  [CONN-TH_XT60PW-M]  13.34 7.87 0 top
XT60OUT  XT60PW-F-OUT  [TH_2P-XT60PW-F]  50.2 7.9 270 top

## Footprints (pads in the part's own frame, mm; a bottom-side part is the same pattern mirrored in y, then rotated)
CONN-TH_XT60PW-M
  round 3.8 hole 2.9: 1(3,-3.6) 2(3,3.6)
  oval 2.2x1.2 hole 1.6x0.6: 3(-3,6.75) 4(-3,-6.75)
R0603
  rect 0.806x0.864 smd: 1(-0.753,0) 2(0.753,0)
SW-SMD_3P-P1.50_L2.7-W6.6
  rect 1x1 smd: 0(-3.8,0.641) 0(-3.8,-1.559) 0(3.8,0.641) 0(3.8,-1.559)
  rect 1x1.4 smd: 1(-2.25,1.559) 2(0.75,1.559) 3(2.25,1.559)
TH_2P-XT60PW-F
  oval 1.3x2.2 hole 0.6x1.5: 1(-6.75,3) 2(6.75,3)
  round 3.8 hole 2.8: 3(-3.6,-3) 4(3.6,-3)
TOLL-8_L10.4-W9.9-P1.20-LS11.7-BL
  rect 0.9x2.2 smd: 1(-4.225,-3.65) 8(4.225,-3.65)
  rect 0.8x2.2 smd: 2(-3,-3.65) 3(-1.8,-3.65) 4(-0.6,-3.65) 5(0.6,-3.65) 6(1.8,-3.65) 7(3,-3.65)
  rect 8.08x0.8 smd: 8(0.64,-2.95)
  rect 10x8.5 smd: 9(0,3.65)

## Nets
As in the schematic, except:
$1N673: C1.2 Q2.1 R4.2

## Via types
v1: diameter 0.61, hole 0.305, Top Layer to Bottom Layer, 1 via

## Routing (per net, layer and track width the routed paths; a pad name or vN(x,y) marks a point on that pad's centre or on a via; arc(x,y) is an arc through that point)
VBAT:
  vias: v1(23.9,7.45)
$1N665: length 3.7
  Top Layer w0.254: R5.2 R4.1 27.45,5 SW1.3
$1N673: length 15.9
  Top Layer w0.254: Q2.1 39.62,10.33 39.2,9.9 30.25,9.9 C1.2 R4.2
$1N772: length 2.9
  Top Layer w0.254: SW1.2 25.89,3.96 R6.2
$1N909: length 2.1
  Top Layer w0.254: R7.2 22.6,4.31 SW1.1

## Copper pours and planes (outline as drawn; the poured copper is in the pictures)
GND on Top Layer: 39.1,10.3 30,10.3 30,0 0,0 0,15.7 39.1,15.7
VBAT on Bottom Layer: 0,15.7 54.75,15.7 54.75,0 0,0
GDRV on Top Layer: 30.4,15.7 54.75,15.7 54.75,0 30.4,0

## Text on the board
Bottom Silkscreen Layer: 300A Max | NMOS low-side eSwitch | Designed by urmouky | - | +

# Board 电荷泵NMOS高侧开关
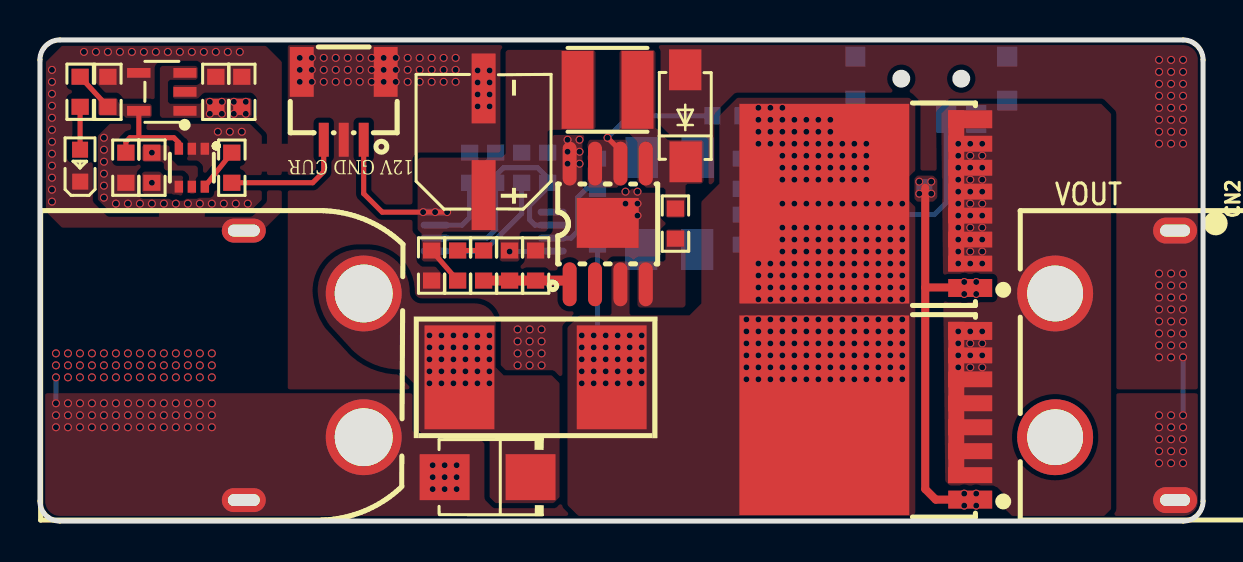
[diagram p4: board, top side]
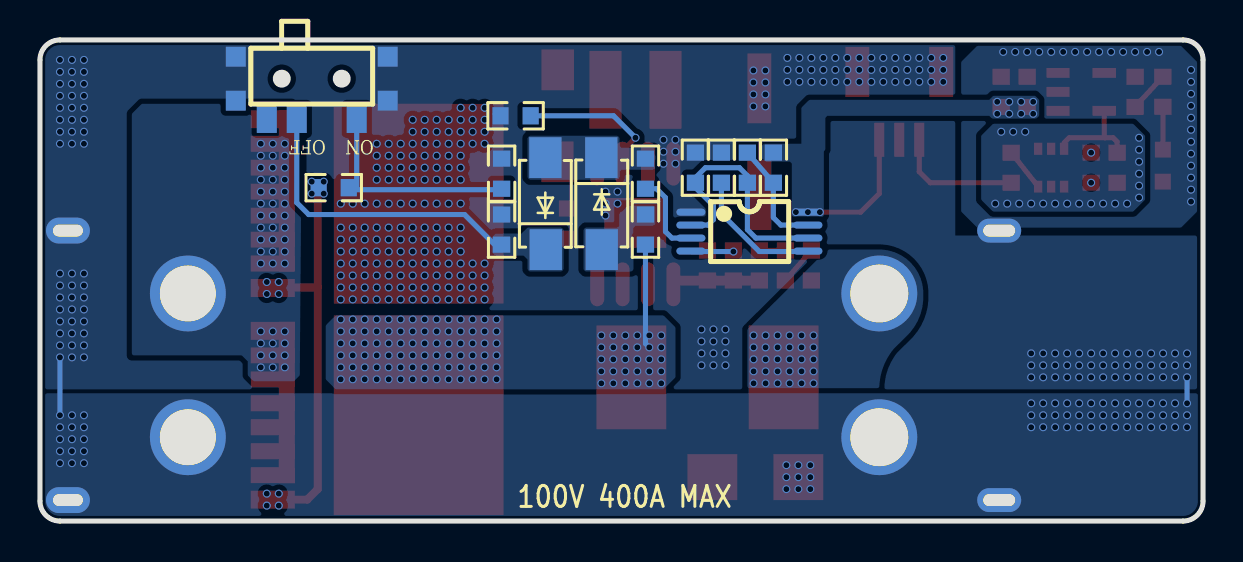
[diagram p5: board, bottom side, seen from below]

Outline 58.2 x 24.1 mm; copper layers: Top Layer, Inner1, Inner2, Bottom Layer. Coordinates in mm from the lower left corner of the outline.
Outline path: 0,23.1 0,1 arc(0.29,0.29) 1,0 57.2,0 arc(57.91,0.29) 58.2,1 58.2,23.1 arc(57.91,23.81) 57.2,24.1 1,24.1 arc(0.29,23.81) 0,23.1
Stack: Top Layer 0.035mm 外层铜厚1oz / Dielectric1 0.2104mm 7628 RC49% 8.6mil / Inner1 0.0152mm 内层铜厚 / Dielectric2 1.065mm 1.1mm H/HOZ Copper / Inner2 0.0152mm 内层铜厚 / Dielectric3 0.2104mm 7628 RC49% 8.6mil / Bottom Layer 0.035mm 外层铜厚1oz

## Design rules (mm)
template: 自定义配置
spacing copperThickness1oz (default): track to track 0.102, other pairs 0 to 0.3
spacing copperThickness2oz: track to track 0.203, other pairs 0.152 to 0.3
track width copperThickness1oz (default): min 0.127, default 0.254, max 2.54
track width copperThickness2oz: min 0.203, default 0.254, max 2.54
differential pair differentialPair (default): width min 0.127, default 0.254, max 2.54; gap min 0.152, default 0.152
via viaSize (default): diameter min 0.4, default 0.4, max 10; hole min 0.3, default 0.3, max 6.3

## Placement (name value [footprint] x y rotation side)
C1  100nF  [R0603]  27.9 17.4 90 bottom
C2  100nF  [R0603]  35.1 14.6 270 bottom
C3  100nF  [R0603]  24.1 17.7 270 bottom
C4  10nF  [R0603]  25.4 17.7 270 bottom
C5  100nF  [R0603]  31.8 14.9 270 top
C6  100nF  [R0603]  20.9 12.8 90 top
C7  10uF  [R0603]  19.6 12.8 90 top
C8  100uF  [cap-smd_bd6.3-l6.6-w6.6-ls7.4-fd]  22.2 19 90 top
C19  1nF  [R0603]  5.6 17.7 90 top
C21  1uF  [R0603]  10.1 21.5 270 top
C22  1uF  [R0603]  8.8 21.5 270 top
C23  1uF  [R0603]  3.4 21.5 270 top
C24  100nF  [R0603]  4.3 17.7 90 top
C25  1nF  [R0603]  34.4 20.3 180 bottom
CN1  XT60PW-M  [CONN-TH_XT60PW-M]  13.2 7.8 0 top
CN2  XT60PW-F  [TH_2P-XT60PW-F]  53.8 7.8 270 top
D1  SS220  [SMA_L4.3-W2.6-LS5.0-FD]  30.1 15.9 90 bottom
D2  SS220  [SMA_L4.3-W2.6-LS5.0-FD]  32.9 15.9 270 bottom
D3  SS220  [SMA_L4.3-W2.6-LS5.0-FD]  32.3 20.3 270 top
D4  SMBJ40A  [SMB_L4.3-W3.6-LS5.3-RD]  22.4 2.2 180 top
INA199A  INA199A1DCKR  [SC-70-6_L2.2-W1.3-P0.65-LS2.1-BR]  7.6 17.7 90 top
L1  47uH  [IND-SMD_L4.0-W4.0_FNR40XXS]  28.4 21.6 180 top
PWR1  NCD0603G1  [LED0603-RD]  2.01 17.8 90 top
Q1  HYG015N10NS1TA  [TOLL-8_L10.4-W9.9-P1.20-LS11.7-BL]  42.9 15.9 90 top
Q2  HYG015N10NS1TA  [TOLL-8_L10.4-W9.9-P1.20-LS11.7-BL]  42.9 5.3 90 top
R1  100Ω  [R0603]  21.5 17.7 90 bottom
R2  750Ω  [R0603]  22.8 17.7 90 bottom
R3  100kΩ  [R0603]  35.1 17.4 270 bottom
R4  100Ω  [R0603]  43.5 16.7 0 bottom
R5  1kΩ  [R0603]  27.9 14.6 90 bottom
R6  10kΩ  [R0603]  24.8 12.8 270 top
R7  590kΩ  [R0603]  23.5 12.8 90 top
R8  4.7kΩ  [R0603]  22.2 12.8 270 top
R18  1mΩ  [R3920]  24.8 7.2 0 top
R28  56Ω  [R0603]  9.6 17.7 270 top
R52  4.7kΩ  [R0603]  2.01 21.5 270 top
SW1  SK-3296S-01-L1  [SW-SMD_3P-P1.50_L2.7-W6.6]  44.6 21.7 0 bottom
U1  100kHz  [TSSOP-8_L4.4-W3.0-P0.65-LS6.4-BL]  22.7 14.5 270 bottom
U4  MP9486AGN-Z  [SOIC-8_L4.9-W3.9-P1.27-LS6.0-BL-EP3.1]  28.41 14.88 0 top
U6  ME6214C33M5G  [SOT-23-5_L3.0-W1.7-P0.95-LS2.8-BL]  6.1 21.5 90 top
U7  WAFER-SH1.0-3PWB  [CONN-SMD_3P-P1.00_WAFER-SH1.0-3PWB]  15.2 20.8 180 top

## Footprints (pads in the part's own frame, mm; a bottom-side part is the same pattern mirrored in y, then rotated)
cap-smd_bd6.3-l6.6-w6.6-ls7.4-fd
  rect 3.5x1.2 smd: 1(-2.67,0) 2(2.67,0)
CONN-SMD_3P-P1.00_WAFER-SH1.0-3PWB
  rect 0.5x1.7 smd: 1(-1,1.7) 2(0,1.7) 3(1,1.7)
  rect 1.2x2.5 smd: 4(-2.1,-1.7) 5(2.1,-1.7)
CONN-TH_XT60PW-M
  round 3.8 hole 2.9: 1(3,-3.6) 2(3,3.6)
  oval 2.2x1.2 hole 1.6x0.6: 3(-3,6.75) 4(-3,-6.75)
IND-SMD_L4.0-W4.0_FNR40XXS
  rect 1.6x3.9 smd: 1(-1.5,0) 2(1.5,0)
LED0603-RD
  rect 0.8x0.8 smd: 1(-0.799,-0.004) 2(0.799,0.004)
R0603
  rect 0.806x0.864 smd: 1(-0.753,0) 2(0.753,0)
R3920
  rect 3.5x5.2 smd: 1(-3.81,0) 2(3.81,0)
SC-70-6_L2.2-W1.3-P0.65-LS2.1-BR
  rect 0.6x0.42 smd: 1(0.95,-0.65) 2(0.95,0) 3(0.95,0.65) 4(-0.95,0.65) 5(-0.95,0) 6(-0.95,-0.65)
SMA_L4.3-W2.6-LS5.0-FD
  rect 2.046x1.62 smd: 1(-2.304,-0.009) 2(2.304,0.009)
SMB_L4.3-W3.6-LS5.3-RD
  rect 2.5x2.3 smd: 1(-2.15,0) 2(2.15,0)
SOIC-8_L4.9-W3.9-P1.27-LS6.0-BL-EP3.1
  oval 0.7x2.2 smd: 1(-1.905,-3.022) 2(-0.635,-3.022) 3(0.635,-3.022) 4(1.905,-3.022) 5(1.905,3.022) 6(0.635,3.022) 7(-0.635,3.022) 8(-1.905,3.022)
  rect 3.1x2.5 smd: 9(0,0.051)
SOT-23-5_L3.0-W1.7-P0.95-LS2.8-BL
  rect 0.49x1.157 smd: 1(-0.95,-1.153) 2(0,-1.153) 3(0.95,-1.153)
  rect 0.49x1.175 smd: 4(0.95,1.153) 5(-0.95,1.153)
SW-SMD_3P-P1.50_L2.7-W6.6
  rect 1x1 smd: 0(-3.8,-1.559) 0(-3.8,0.641) 0(3.8,-1.559) 0(3.8,0.641)
  rect 1x1.4 smd: 1(-2.25,1.559) 2(0.75,1.559) 3(2.25,1.559)
TH_2P-XT60PW-F
  oval 1.3x2.2 hole 0.6x1.5: 1(-6.75,3) 2(6.75,3)
  round 3.8 hole 2.8: 3(-3.6,-3) 4(3.6,-3)
TOLL-8_L10.4-W9.9-P1.20-LS11.7-BL
  rect 0.9x2.2 smd: 1(-4.225,-3.65) 8(4.225,-3.65)
  rect 0.8x2.2 smd: 2(-3,-3.65) 3(-1.8,-3.65) 4(-0.6,-3.65) 5(0.6,-3.65) 6(1.8,-3.65) 7(3,-3.65)
  rect 8.08x0.8 smd: 8(0.64,-2.95)
  rect 10x8.5 smd: 9(0,3.65)
TSSOP-8_L4.4-W3.0-P0.65-LS6.4-BL
  oval 0.353x1.454 smd: 1(-0.975,-2.927) 2(-0.325,-2.927) 3(0.325,-2.927) 4(0.975,-2.927) 5(0.975,2.927) 6(0.325,2.927) 7(-0.325,2.927) 8(-0.975,2.927)

## Nets
As in the schematic, except:
AGND: C24.1 INA199A.1 INA199A.2
GND: C2.1 C3.1 C4.1 C7.1 C8.2 C21.1 C22.1 C23.1 C25.1 CN1.1 CN1.3 CN1.4 CN2.1 CN2.2 CN2.4 D3.1 D4.2 PWR1.1 R3.1 R6.1 SW1.0 U1.1 U4.8 U4.9 U6.2 U6.4 U7.2 U7.4 U7.5

Pads without a net: SW1 3; U4 2

## Via types
v1: diameter 0.4, hole 0.3, Top Layer to Bottom Layer, 639 vias

## Routing (per net, layer and track width the routed paths; a pad name or vN(x,y) marks a point on that pad's centre or on a via; arc(x,y) is an arc through that point)
3V3_LDO: length 7.1
  Top Layer w0.254: U6.5 4.95,19.25 4.9,19.2 ; C24.2 4.3,19 4.5,19.2 4.9,19.2 ; R52.1 C23.2 ; 4.9,19.2 6.7,19.2 6.95,18.95 INA199A.3
12V_DCDC: length 11.4
  Top Layer w0.254: C7.2 C6.1 ; U7.1 16.2,16.4 17.12,15.47 v1(19.17,15.47) v1(19.77,15.47) v1(20.37,15.47)
  Bottom Layer w0.254: 25.63,13.53 25.6,13.5 v1(23.5,13.5)
  vias: v1(8.5,21) v1(8.5,20.4) v1(9.1,21) v1(9.1,20.4) v1(9.7,21) v1(9.7,20.4) v1(10.3,21) v1(10.3,20.4)
AGND:
  vias: v1(3.2,19.2) v1(3.2,18.6) v1(3.2,18) v1(3.2,17.4) v1(3.2,16.8) v1(3.2,16.2) v1(3.8,15.9) v1(4.4,15.9) v1(5,15.9) v1(5.6,15.9) v1(6.2,15.9) v1(6.8,15.9) v1(7.4,15.9) v1(8,15.9) v1(8.6,15.9) v1(8.9,19.5) v1(9.2,15.9) v1(9.5,19.5) v1(9.8,15.9) v1(10.1,19.5) v1(10.4,15.9)
GND: length 4.2
  Bottom Layer w0.254: v1(57.2,5.3) v1(57.2,8.2) ; v1(0.8,5.9) v1(0.8,7.2)
  vias: v1(0.6,22.6) v1(0.6,22) v1(0.6,21.4) v1(0.6,20.8) v1(0.6,20.2) v1(0.6,19.6) v1(0.6,19) v1(0.6,18.4) v1(0.6,17.8) v1(0.6,17.2) v1(0.6,16.6) v1(0.6,16) v1(0.8,8.4) v1(0.8,7.8) v1(0.8,5.3) v1(0.8,4.7) v1(1.4,8.4) v1(1.4,7.8) v1(1.4,7.2) v1(1.4,5.9) v1(1.4,5.3) v1(1.4,4.7) v1(2,8.4) v1(2,7.8) v1(2,7.2) v1(2,5.9) v1(2,5.3) v1(2,4.7) v1(2.2,23.5) v1(2.6,8.4) v1(2.6,7.8) v1(2.6,7.2) v1(2.6,5.9) v1(2.6,5.3) v1(2.6,4.7) v1(2.8,23.5) v1(3.2,8.4) v1(3.2,7.8) v1(3.2,7.2) v1(3.2,5.9) v1(3.2,5.3) v1(3.2,4.7) v1(3.4,23.5) v1(3.8,8.4) v1(3.8,7.8) v1(3.8,7.2) v1(3.8,5.9) v1(3.8,5.3) v1(3.8,4.7) v1(4,23.5) v1(4.4,8.4) v1(4.4,7.8) v1(4.4,7.2) v1(4.4,5.9) v1(4.4,5.3) v1(4.4,4.7) v1(4.6,23.5) v1(5,8.4) v1(5,7.8) v1(5,7.2) v1(5,5.9) v1(5,5.3) v1(5,4.7) v1(5.2,23.5) v1(5.6,8.4) v1(5.6,7.8) v1(5.6,7.2) v1(5.6,5.9) v1(5.6,5.3) v1(5.6,4.7) v1(5.8,23.5) v1(6.2,8.4) v1(6.2,7.8) v1(6.2,7.2) v1(6.2,5.9) v1(6.2,5.3) v1(6.2,4.7) v1(6.4,23.5) v1(6.8,8.4) v1(6.8,7.8) v1(6.8,7.2) v1(6.8,5.9) v1(6.8,5.3) v1(6.8,4.7) v1(7,23.5) v1(7.4,8.4) v1(7.4,7.8) v1(7.4,7.2) v1(7.4,5.9) v1(7.4,5.3) v1(7.4,4.7) v1(7.6,23.5) v1(8,8.4) v1(8,7.8) v1(8,7.2) v1(8,5.9) v1(8,5.3) v1(8,4.7) v1(8.2,23.5) v1(8.6,8.4) v1(8.6,7.8) v1(8.6,7.2) v1(8.6,5.9) v1(8.6,5.3) v1(8.6,4.7) v1(8.8,23.5) v1(9.4,23.5) v1(10,23.5) v1(13,23.2) v1(13,22.6) v1(13,22) v1(13.6,23.2) v1(13.6,22.6) v1(13.6,22) v1(14.2,23.2) v1(14.2,22.6) v1(14.2,22) v1(14.8,23.2) v1(14.8,22.6) v1(14.8,22) v1(15.4,23.2) v1(15.4,22.6) v1(15.4,22) v1(16,23.2) v1(16,22.6) v1(16,22) v1(16.6,23.2) v1(16.6,22.6) v1(16.6,22) v1(17.2,23.2) v1(17.2,22.6) v1(17.2,22) v1(17.8,23.2) v1(17.8,22.6) v1(17.8,22) v1(18.4,23.2) v1(18.4,22.6) v1(18.4,22) v1(19,23.2) v1(19,22.6) v1(19,22) v1(19.6,23.2) v1(19.6,22.6) v1(19.6,22) v1(19.65,2.8) v1(19.65,2.2) v1(19.65,1.6) v1(20.2,23.2) v1(20.2,22.6) v1(20.2,22) v1(20.25,2.8) v1(20.25,2.2) v1(20.25,1.6) v1(20.8,23.2) v1(20.8,22.6) v1(20.8,22) v1(20.85,2.8) v1(20.85,2.2) v1(20.85,1.6) v1(21.9,22.57) v1(21.9,21.97) v1(21.9,21.37) v1(21.9,20.77) v1(22.5,22.57) v1(22.5,21.97) v1(22.5,21.37) v1(22.5,20.77) v1(23.9,9.6) v1(23.9,9) v1(23.9,8.4) v1(23.9,7.8) v1(24.5,9.6) v1(24.5,9) v1(24.5,8.4) v1(24.5,7.8) v1(25.1,9.6) v1(25.1,9) v1(25.1,8.4) v1(25.1,7.8) v1(26.4,19.1) v1(26.4,18.5) v1(26.4,17.9) v1(27,19.1) v1(27,18.5) v1(27,17.9) v1(29.3,16.5) v1(29.3,15.9) v1(29.9,16.5) v1(29.9,15.9) v1(29.9,15.3) v1(56,23.1) v1(56,22.5) v1(56,21.9) v1(56,21.3) v1(56,20.7) v1(56,20.1) v1(56,19.5) v1(56,18.9) v1(56,12.4) v1(56,11.8) v1(56,11.2) v1(56,10.6) v1(56,10) v1(56,9.4) v1(56,8.8) v1(56,8.2) v1(56,5.3) v1(56,4.7) v1(56,4.1) v1(56,3.5) v1(56,2.9) v1(56.6,23.1) v1(56.6,22.5) v1(56.6,21.9) v1(56.6,21.3) v1(56.6,20.7) v1(56.6,20.1) v1(56.6,19.5) v1(56.6,18.9) v1(56.6,12.4) v1(56.6,11.8) v1(56.6,11.2) v1(56.6,10.6) v1(56.6,10) v1(56.6,9.4) v1(56.6,8.8) v1(56.6,8.2) v1(56.6,5.3) v1(56.6,4.7) v1(56.6,4.1) v1(56.6,3.5) v1(56.6,2.9) v1(57.2,23.1) v1(57.2,22.5) v1(57.2,21.9) v1(57.2,21.3) v1(57.2,20.7) v1(57.2,20.1) v1(57.2,19.5) v1(57.2,18.9) v1(57.2,12.4) v1(57.2,11.8) v1(57.2,11.2) v1(57.2,10.6) v1(57.2,10) v1(57.2,9.4) v1(57.2,8.8) v1(57.2,4.7) v1(57.2,4.1) v1(57.2,3.5) v1(57.2,2.9)
VBAT: length 34.2
  Inner1 w0.254: v1(5.6,18.45) 6.15,17.9 22.7,17.9 24.9,15.7 24.9,12.3 26.2,11 26.2,9.01 v1(27.11,8.1)
  Bottom Layer w0.254: R5.1 27.9,8.89 v1(27.71,8.7)
  vias: v1(27.11,9.3) v1(27.11,8.7) v1(27.11,7.5) v1(27.11,6.9) v1(27.71,9.3) v1(27.71,8.1) v1(27.71,7.5) v1(27.71,6.9) v1(28.31,9.3) v1(28.31,8.7) v1(28.31,8.1) v1(28.31,7.5) v1(28.31,6.9) v1(28.91,9.3) v1(28.91,8.7) v1(28.91,8.1) v1(28.91,7.5) v1(28.91,6.9) v1(29.51,9.3) v1(29.51,8.7) v1(29.51,8.1) v1(29.51,7.5) v1(29.51,6.9) v1(30.11,9.3) v1(30.11,8.7) v1(30.11,8.1) v1(30.11,7.5) v1(30.11,6.9) v1(35.35,10.1) v1(35.35,9.5) v1(35.35,8.9) v1(35.35,8.3) v1(35.35,7.7) v1(35.35,7.1) v1(35.95,20.7) v1(35.95,20.1) v1(35.95,19.5) v1(35.95,18.9) v1(35.95,12.9) v1(35.95,12.3) v1(35.95,11.7) v1(35.95,11.1) v1(35.95,10.1) v1(35.95,9.5) v1(35.95,8.9) v1(35.95,8.3) v1(35.95,7.7) v1(35.95,7.1) v1(36.55,20.7) v1(36.55,20.1) v1(36.55,19.5) v1(36.55,18.9) v1(36.55,12.9) v1(36.55,12.3) v1(36.55,11.7) v1(36.55,11.1) v1(36.55,10.1) v1(36.55,9.5) v1(36.55,8.9) v1(36.55,8.3) v1(36.55,7.7) v1(36.55,7.1) v1(37.15,20.7) v1(37.15,20.1) v1(37.15,19.5) v1(37.15,18.9) v1(37.15,18.3) v1(37.15,17.7) v1(37.15,17.1) v1(37.15,15.9) v1(37.15,14.7) v1(37.15,14.1) v1(37.15,13.5) v1(37.15,12.9) v1(37.15,12.3) v1(37.15,11.7) v1(37.15,11.1) v1(37.15,10.1) v1(37.15,9.5) v1(37.15,8.9) v1(37.15,8.3) v1(37.15,7.7) v1(37.15,7.1) v1(37.75,20.1) v1(37.75,19.5) v1(37.75,18.9) v1(37.75,18.3) v1(37.75,17.7) v1(37.75,17.1) v1(37.75,15.9) v1(37.75,14.7) v1(37.75,14.1) v1(37.75,13.5) v1(37.75,12.9) v1(37.75,12.3) v1(37.75,11.7) v1(37.75,11.1) v1(37.75,10.1) v1(37.75,9.5) v1(37.75,8.9) v1(37.75,8.3) v1(37.75,7.7) v1(37.75,7.1) v1(38.35,20.1) v1(38.35,19.5) v1(38.35,18.9) v1(38.35,18.3) v1(38.35,17.7) v1(38.35,17.1) v1(38.35,15.9) v1(38.35,14.7) v1(38.35,14.1) v1(38.35,13.5) v1(38.35,12.9) v1(38.35,12.3) v1(38.35,11.7) v1(38.35,11.1) v1(38.35,10.1) v1(38.35,9.5) v1(38.35,8.9) v1(38.35,8.3) v1(38.35,7.7) v1(38.35,7.1) v1(38.95,20.1) v1(38.95,19.5) v1(38.95,18.9) v1(38.95,18.3) v1(38.95,17.7) v1(38.95,17.1) v1(38.95,15.9) v1(38.95,14.7) v1(38.95,14.1) v1(38.95,13.5) v1(38.95,12.9) v1(38.95,12.3) v1(38.95,11.7) v1(38.95,11.1) v1(38.95,10.1) v1(38.95,9.5) v1(38.95,8.9) v1(38.95,8.3) v1(38.95,7.7) v1(38.95,7.1) v1(39.55,20.1) v1(39.55,19.5) v1(39.55,18.9) v1(39.55,18.3) v1(39.55,17.7) v1(39.55,17.1) v1(39.55,15.9) v1(39.55,14.7) v1(39.55,14.1) v1(39.55,13.5) v1(39.55,12.9) v1(39.55,12.3) v1(39.55,11.7) v1(39.55,11.1) v1(39.55,10.1) v1(39.55,9.5) v1(39.55,8.9) v1(39.55,8.3) v1(39.55,7.7) v1(39.55,7.1) v1(40.15,18.9) v1(40.15,18.3) v1(40.15,17.7) v1(40.15,17.1) v1(40.15,15.9) v1(40.15,14.7) v1(40.15,14.1) v1(40.15,13.5) v1(40.15,12.9) v1(40.15,12.3) v1(40.15,11.7) v1(40.15,11.1) v1(40.15,10.1) v1(40.15,9.5) v1(40.15,8.9) v1(40.15,8.3) v1(40.15,7.7) v1(40.15,7.1) v1(40.75,18.9) v1(40.75,18.3) v1(40.75,17.7) v1(40.75,17.1) v1(40.75,15.9) v1(40.75,14.7) v1(40.75,14.1) v1(40.75,13.5) v1(40.75,12.9) v1(40.75,12.3) v1(40.75,11.7) v1(40.75,11.1) v1(40.75,10.1) v1(40.75,9.5) v1(40.75,8.9) v1(40.75,8.3) v1(40.75,7.7) v1(40.75,7.1) v1(41.35,18.9) v1(41.35,18.3) v1(41.35,17.7) v1(41.35,17.1) v1(41.35,15.9) v1(41.35,14.7) v1(41.35,14.1) v1(41.35,13.5) v1(41.35,12.9) v1(41.35,12.3) v1(41.35,11.7) v1(41.35,11.1) v1(41.35,10.1) v1(41.35,9.5) v1(41.35,8.9) v1(41.35,8.3) v1(41.35,7.7) v1(41.35,7.1) v1(41.95,15.9) v1(41.95,14.7) v1(41.95,14.1) v1(41.95,13.5) v1(41.95,12.9) v1(41.95,12.3) v1(41.95,11.7) v1(41.95,11.1) v1(41.95,10.1) v1(41.95,9.5) v1(41.95,8.9) v1(41.95,8.3) v1(41.95,7.7) v1(41.95,7.1) v1(42.55,15.9) v1(42.55,14.7) v1(42.55,14.1) v1(42.55,13.5) v1(42.55,12.9) v1(42.55,12.3) v1(42.55,11.7) v1(42.55,11.1) v1(42.55,10.1) v1(42.55,9.5) v1(42.55,8.9) v1(42.55,8.3) v1(42.55,7.7) v1(42.55,7.1) v1(43.15,15.9) v1(43.15,14.7) v1(43.15,14.1) v1(43.15,13.5) v1(43.15,12.9) v1(43.15,12.3) v1(43.15,11.7) v1(43.15,11.1) v1(43.15,10.1) v1(43.15,9.5) v1(43.15,8.9) v1(43.15,8.3) v1(43.15,7.7) v1(43.15,7.1)
VIN: length 28.2
  Inner1 w0.254: v1(22.49,8.1) 23.3,8.91 23.3,11.1 24.5,12.3 24.5,15.5 22.5,17.5 6.15,17.5 v1(5.6,16.95)
  vias: v1(19.49,9.3) v1(19.49,8.7) v1(19.49,8.1) v1(19.49,7.5) v1(19.49,6.9) v1(20.09,9.3) v1(20.09,8.7) v1(20.09,8.1) v1(20.09,7.5) v1(20.09,6.9) v1(20.69,9.3) v1(20.69,8.7) v1(20.69,8.1) v1(20.69,7.5) v1(20.69,6.9) v1(21.29,9.3) v1(21.29,8.7) v1(21.29,8.1) v1(21.29,7.5) v1(21.29,6.9) v1(21.89,9.3) v1(21.89,8.7) v1(21.89,8.1) v1(21.89,7.5) v1(21.89,6.9) v1(22.49,9.3) v1(22.49,8.7) v1(22.49,7.5) v1(22.49,6.9)
SENS_CUR: length 6.4
  Top Layer w0.254: R28.2 13.65,16.95 14.2,17.5 U7.3
SIGSOURCE: length 4.3
  Bottom Layer w0.254: 25.63,14.17 26.57,14.17 26.9,14.5 26.9,16.2 27.35,16.65 C1.1
TRIG: length 12.6
  Bottom Layer w0.254: U1.6 22.38,14.17 22.8,14.6 R2.1 22.8,17.3 23.2,17.7 24.9,17.7 25.4,17.2 C4.2 25.4,16.7 24.5,15.8 24.5,15.1 24.78,14.83 25.63,14.83
VOUT:
  vias: v1(45.95,18.9) v1(45.95,18.3) v1(45.95,17.7) v1(45.95,17.1) v1(45.95,16.5) v1(45.95,15.9) v1(45.95,15.3) v1(45.95,14.7) v1(45.95,14.1) v1(45.95,13.5) v1(45.95,12.9) v1(45.95,9.5) v1(45.95,8.9) v1(45.95,8.3) v1(45.95,7.7) v1(46.55,18.9) v1(46.55,18.3) v1(46.55,17.7) v1(46.55,17.1) v1(46.55,16.5) v1(46.55,15.9) v1(46.55,15.3) v1(46.55,14.7) v1(46.55,14.1) v1(46.55,13.5) v1(46.55,12.9) v1(46.55,9.5) v1(46.55,8.9) v1(46.55,8.3) v1(46.55,7.7) v1(47.15,18.9) v1(47.15,18.3) v1(47.15,17.7) v1(47.15,17.1) v1(47.15,16.5) v1(47.15,15.9) v1(47.15,15.3) v1(47.15,14.7) v1(47.15,14.1) v1(47.15,13.5) v1(47.15,12.9) v1(47.15,9.5) v1(47.15,8.9) v1(47.15,8.3) v1(47.15,7.7)
$1N589: length 5.6
  Bottom Layer w0.254: U1.7 21.12,14.83 21.5,15.2 R1.1 R2.2
$1N672: length 6.7
  Bottom Layer w0.254: C3.2 24.1,15.4 22.2,13.5 19.8,13.5 U1.5
$1N1162: length 19.8
  Top Layer w0.4: 44.3,11.7 46.53,11.7 Q1.1 ; 44.3,11.7 44.3,16.7 ; 44.3,11.7 44.3,1.6 44.82,1.08 Q2.1
  vias: v1(44,17) v1(44,16.4) v1(44.6,17) v1(44.6,16.4) v1(46.25,11.97) v1(46.25,11.38) v1(46.25,1.38) v1(46.25,0.78) v1(46.85,11.97) v1(46.85,11.38) v1(46.85,1.38) v1(46.85,0.78)
$1N1165: length 10.8
  Bottom Layer w0.254: SW1.1 42.35,16.6 35.15,16.6 R3.2
$1N1432: length 15.3
  Bottom Layer w0.254: SW1.2 45.35,15.95 44.75,15.35 36.95,15.35 35.45,13.85 C2.2
$1N3050: length 7.3
  Top Layer w0.254: v1(28.4,19.2) 29.05,18.55 U4.6
  Bottom Layer w0.254: v1(28.4,19.2) 29.5,20.3 C25.2
$1N3363: length 4.4
  Top Layer w0.5: U4.1 26.32,12.05 R6.2 R7.1 R8.2
$1N3435: length 1.3
  Top Layer w0.254: C6.2 R8.1
$1N4038: length 2.2
  Top Layer w0.254: 8.23,16.73 9.58,18.44
$1N4588: length 2.2
  Top Layer w0.254: 2.01,18.6 2.01,20.85 2.01,20.85

## Copper pours and planes (outline as drawn; the poured copper is in the pictures)
3V3_LDO on Top Layer: 5.6,20.8 5.5,20.9 4,20.9 3.9,21 3.9,21.1 3.8,21.2 3,21.2 2.9,21.1 2.9,20.4 3,20.3 4.2,20.3 4.3,20.2 5.5,20.2 5.6,20.3
12V_DCDC on Top Layer: 8,20.9 8.3,21.2 10.5,21.2 10.6,21.1 10.6,20.3 10.5,20.2 6.1,20.2 6,20.3 6,22.7 6.1,22.8 7.8,22.8 7.9,22.7 7.9,22.2 7.8,22.1 6.5,22.1 6.4,22 6.4,21 6.5,20.9
12V_DCDC on Top Layer: 19.1,13.1 19.1,14.4 18.9,14.6 18.9,18.1 19,18.2 23.1,18.2 23.3,18.4 23.3,23.5 23.4,23.6 27.7,23.6 27.8,23.5 27.8,19.7 27.7,19.6 25.5,19.6 25.4,19.5 25.4,14.6 25.3,14.5 24.1,14.5 24,14.4 24,13.1 23.9,13 23.1,13 23,13.1 23,14.4 22.9,14.5 20.2,14.5 20.1,14.4 20.1,13.1 20,13 19.2,13
12V_DCDC on Bottom Layer: 18.8,20.3 10.7,20.3 10.5,20.1 8.4,20.1 8.2,20.3 8.2,21.1 8.4,21.3 10.5,21.3 10.7,21.1 19.7,21.1 20.1,20.7 20.1,18.5 19,18.5 18.9,18.6 18.9,20.2
12V_DCDC on Bottom Layer: 20.47,15.2 20.57,15.3 20.57,17.9 20.67,18 21.97,18 22.07,18.1 22.07,18.8 21.97,18.9 19.07,18.9 18.97,18.8 18.97,15.3 19.07,15.2
AGND on Top Layer: 10.6,18.9 12.9,18.9 12.9,17.5 10.6,17.5
AGND on Top Layer: 11.1,19.3 10.5,19.9 3.5,19.9 2.9,19.3 2.9,16.1 3.5,15.5 10.5,15.5 11.1,16.1
AGND on Top Layer: 5.95,15.9 8.25,15.9 8.25,14.9 5.95,14.9
AGND on Bottom Layer: 11.1,19.3 10.5,19.9 3.5,19.9 2.9,19.3 2.9,16.1 3.5,15.5 10.5,15.5 11.1,16.1
AGND on Inner1: 11.1,19.3 10.5,19.9 3.5,19.9 2.9,19.3 2.9,16.1 3.5,15.5 10.5,15.5 11.1,16.1
AGND on Inner2: 11.1,19.3 10.5,19.9 3.5,19.9 2.9,19.3 2.9,16.1 3.5,15.5 10.5,15.5 11.1,16.1
GND on Top Layer: 11.6,18.9 12.9,18.9 12.9,15.3 11.6,15.3
GND on Top Layer: 0,6.4 0,0.1 58.2,0.1 58.2,6.4
GND on Top Layer: 12.4,24.1 58.2,24.1 58.2,6.6 12.4,6.6
GND on Top Layer: 1.1,23.8 0.3,23 0.3,15.5 1.1,14.7 11.3,14.7 12.1,15.5 12.1,23 11.3,23.8
GND on Bottom Layer: 0,6.4 0,0.1 58.2,0.1 58.2,6.4
GND on Bottom Layer: 1.1,23.8 0.3,23 0.3,15.5 1.1,14.7 11.3,14.7 12.1,15.5 12.1,23 11.3,23.8
GND on Bottom Layer: 0.3,14.3 12.4,14.3 12.4,24.1 58.2,24.1 58.2,6.6 0.3,6.6
GND on Inner1: 0,6.4 0,0.1 58.2,0.1 58.2,6.4
GND on Inner1: 0.3,14.3 12.4,14.3 12.4,24.1 58.2,24.1 58.2,6.6 0.3,6.6
GND on Inner1: 1.1,23.8 0.3,23 0.3,15.5 1.1,14.7 11.3,14.7 12.1,15.5 12.1,23 11.3,23.8
GND on Inner2: 1.1,23.8 0.3,23 0.3,15.5 1.1,14.7 11.3,14.7 12.1,15.5 12.1,23 11.3,23.8
GND on Inner2: 0.3,14.3 12.4,14.3 12.4,24.1 58.2,24.1 58.2,6.6 0.3,6.6
GND on Inner2: 0,6.4 0,0.1 58.2,0.1 58.2,6.4
VBAT on Top Layer: 5.2,18 6.1,18 6.2,17.9 6.2,17.5 6.3,17.4 7.2,17.4 7.3,17.3 7.3,16.5 7.4,16.4 7.8,16.4 7.9,16.5 7.9,17.7 7.8,17.8 6.9,17.8 6.5,18.2 6.5,18.8 6.4,18.9 5.2,18.9 5.1,18.8 5.1,18.1
VBAT on Top Layer: 27,10.3 26.4,9.7 26.4,0.8 27,0.2 43.6,0.2 43.8,0.4 43.8,20.9 43.5,21.2 34.9,21.2 34,20.3 34,16.9 33.1,16 33.1,10.9 32.5,10.3
VBAT on Top Layer: 28.7,13 28.6,12.9 28.6,10.4 28.4,10.2 29.7,10.2 29.5,10.4 29.5,12.9 29.4,13
VBAT on Bottom Layer: 26.4,9.7 27,10.3 43.4,10.3 43.9,9.8 43.9,7.1 43.4,6.6 27,6.6 26.4,7.2
VBAT on Inner1: 27,10.3 26.7,10 26.7,6.9 27,6.6 43.2,6.6 43.8,7.2 43.8,20.6 43.2,21.2 34.6,21.2 34,20.6 34,16.9 33.1,16 33.1,10.9 32.5,10.3
VBAT on Inner2: 26.8,10.3 26.3,9.8 26.3,7.1 26.8,6.6 43.2,6.6 43.8,7.2 43.8,20.6 43.2,21.2 34.6,21.2 34,20.6 34,16.9 33.1,16 33.1,10.9 32.5,10.3
VIN on Top Layer: 7.2,17.2 7.1,17.3 6.2,17.3 6,17.5 5.2,17.5 5.1,17.4 5.1,16.5 5.2,16.4 6.6,16.4 6.7,16.3 7.1,16.3 7.2,16.4
VIN on Top Layer: 22.5,1.2 22.5,4 22.1,4.4 19.1,4.4 18.9,4.6 18.9,6.7 18,7.6 16.71,7.86 15.61,8.59 14.5,9.8 14.08,10.61 13.9,11.5 14.03,12.27 14.43,12.93 15.05,13.4 15.8,13.6 16.4,13.6 17.88,12.98 18.68,11.08 19.1,10.9 21.78,10.9 22.17,10.82 22.5,10.6 22.72,10.27 22.8,9.88 22.8,7.7 23.2,7.3 25.6,7.3 26,6.9 26,1.2 25.7,0.9 22.8,0.9
VIN on Bottom Layer: 14,11.38 14.64,12.95 16.2,13.6 18.8,13.6 22.8,9.6 22.8,6.6 16.2,6.6 16.02,7.66 15.49,8.61 14.8,9.3 14.21,10.19 14,11.23
VIN on Inner1: 19.2,9.6 22.8,9.6 22.8,6.6 19.2,6.6
VIN on Inner1: 14,11.38 14.64,12.95 16.2,13.6 18.8,13.6 22.8,9.6 22.8,6.6 16.2,6.6 16.02,7.66 15.49,8.61 14.8,9.3 14.21,10.19 14,11.23
VIN on Inner2: 14,11.38 14.64,12.95 16.2,13.6 18.8,13.6 22.8,9.6 22.8,6.6 16.4,6.6 16.2,6.8 16.2,6.9 16.02,7.82 15.49,8.61 14.8,9.3 14.21,10.19 14,11.23
VOUT on Top Layer: 45.1,20.4 45.6,20.9 53.1,20.9 53.6,20.4 53.6,0.6 53.1,0.1 48.8,0.1 48.3,0.6 48.3,1.3 47.9,1.7 45.6,1.7 45.3,2
VOUT on Bottom Layer: 45.2,7.3 45.1,20.4 45.6,20.9 53.1,20.9 53.6,20.4 53.6,8.3 48.1,8.3 47.8,8 47.8,7.3 47.5,7 45.5,7
VOUT on Inner1: 45.2,7.3 45.1,20.4 45.6,20.9 53.1,20.9 53.6,20.4 53.6,8.3 48.1,8.3 47.8,8 47.8,7.3 47.5,7 45.5,7
VOUT on Inner2: 45.2,7.3 45.1,20.4 45.6,20.9 53.1,20.9 53.6,20.4 53.6,8.3 48.1,8.3 47.8,8 47.8,7.3 47.5,7 45.5,7
$1N251 on Bottom Layer: 33.8,19.2 33.7,19.3 29.3,19.3 29.2,19.2 29.2,18.8 29.1,18.7 27.5,18.7 27.4,18.6 27.4,17.7 27.5,17.6 29.1,17.6 29.2,17.5 29.2,17.2 29.3,17.1 33.7,17.1 33.8,17.2
$1N1162 on Top Layer: 43.9,17.3 43.7,17.1 43.7,16.2 43.9,16 44.7,16 44.9,16.2 44.9,17.1 44.7,17.3
$1N1432 on Bottom Layer: 35.4,14.4 34.1,14.4 33.8,14.7 32.1,14.7 32,14.6 32,12.6 32.1,12.5 33.7,12.5 33.8,12.6 33.8,13.1 34,13.3 35.4,13.3 35.6,13.5 35.6,14.2
$1N1532 on Bottom Layer: 30.9,12.5 31,12.6 31,14.6 30.9,14.7 29.3,14.7 29.2,14.8 29.2,15.7 29.1,15.8 27.5,15.8 27.4,15.7 27.4,14.9 27.5,14.8 28.4,14.8 28.5,14.7 28.5,12.6 28.6,12.5
$1N2915 on Top Layer: 31.4,14.6 31.3,14.5 31.3,13.1 31.2,13 30,13 29.9,12.9 29.9,10.8 30,10.7 32.2,10.7 32.3,10.8 32.3,14.5 32.2,14.6
$1N2959 on Top Layer: 30,16.7 29.9,16.8 29.9,19 29.4,19.5 29.1,19.5 29,19.6 29,23.5 29.1,23.6 30.7,23.6 30.8,23.5 30.8,19.7 31.4,19.1 33.1,19.1 33.2,19 33.2,17 33.1,16.9 32.4,16.9 32.3,16.8 32.3,15.3 32.2,15.2 31.4,15.2 31.3,15.3 31.3,16.6 31.2,16.7
$1N3050 on Top Layer: 27.5,19.1 27.4,19 27.4,16.8 27.5,16.7 29.3,16.7 29.4,16.8 29.4,19 29.3,19.1

## Text on the board
Bottom Solder Mask Layer: V0.1 | Designed by urmouky | High-side Anti-ignition module
Bottom Silkscreen Layer: 100V 400A MAX | ON | OFF
Top Silkscreen Layer: VOUT | 12V GND CUR
